# EasyEDA Pro project PixelScreen_WS2812B.eprj

# Schematic Schematic1

## Sheets
1 P1: Create Date: 2023-01-23; Page Name: P1; Project Name: PixelScreen_WS2812B; Schematic Name: Schematic1; Update Date: 2023-01-24; Company: 嘉立创EDA; Page Size: A4; Version: V1.0
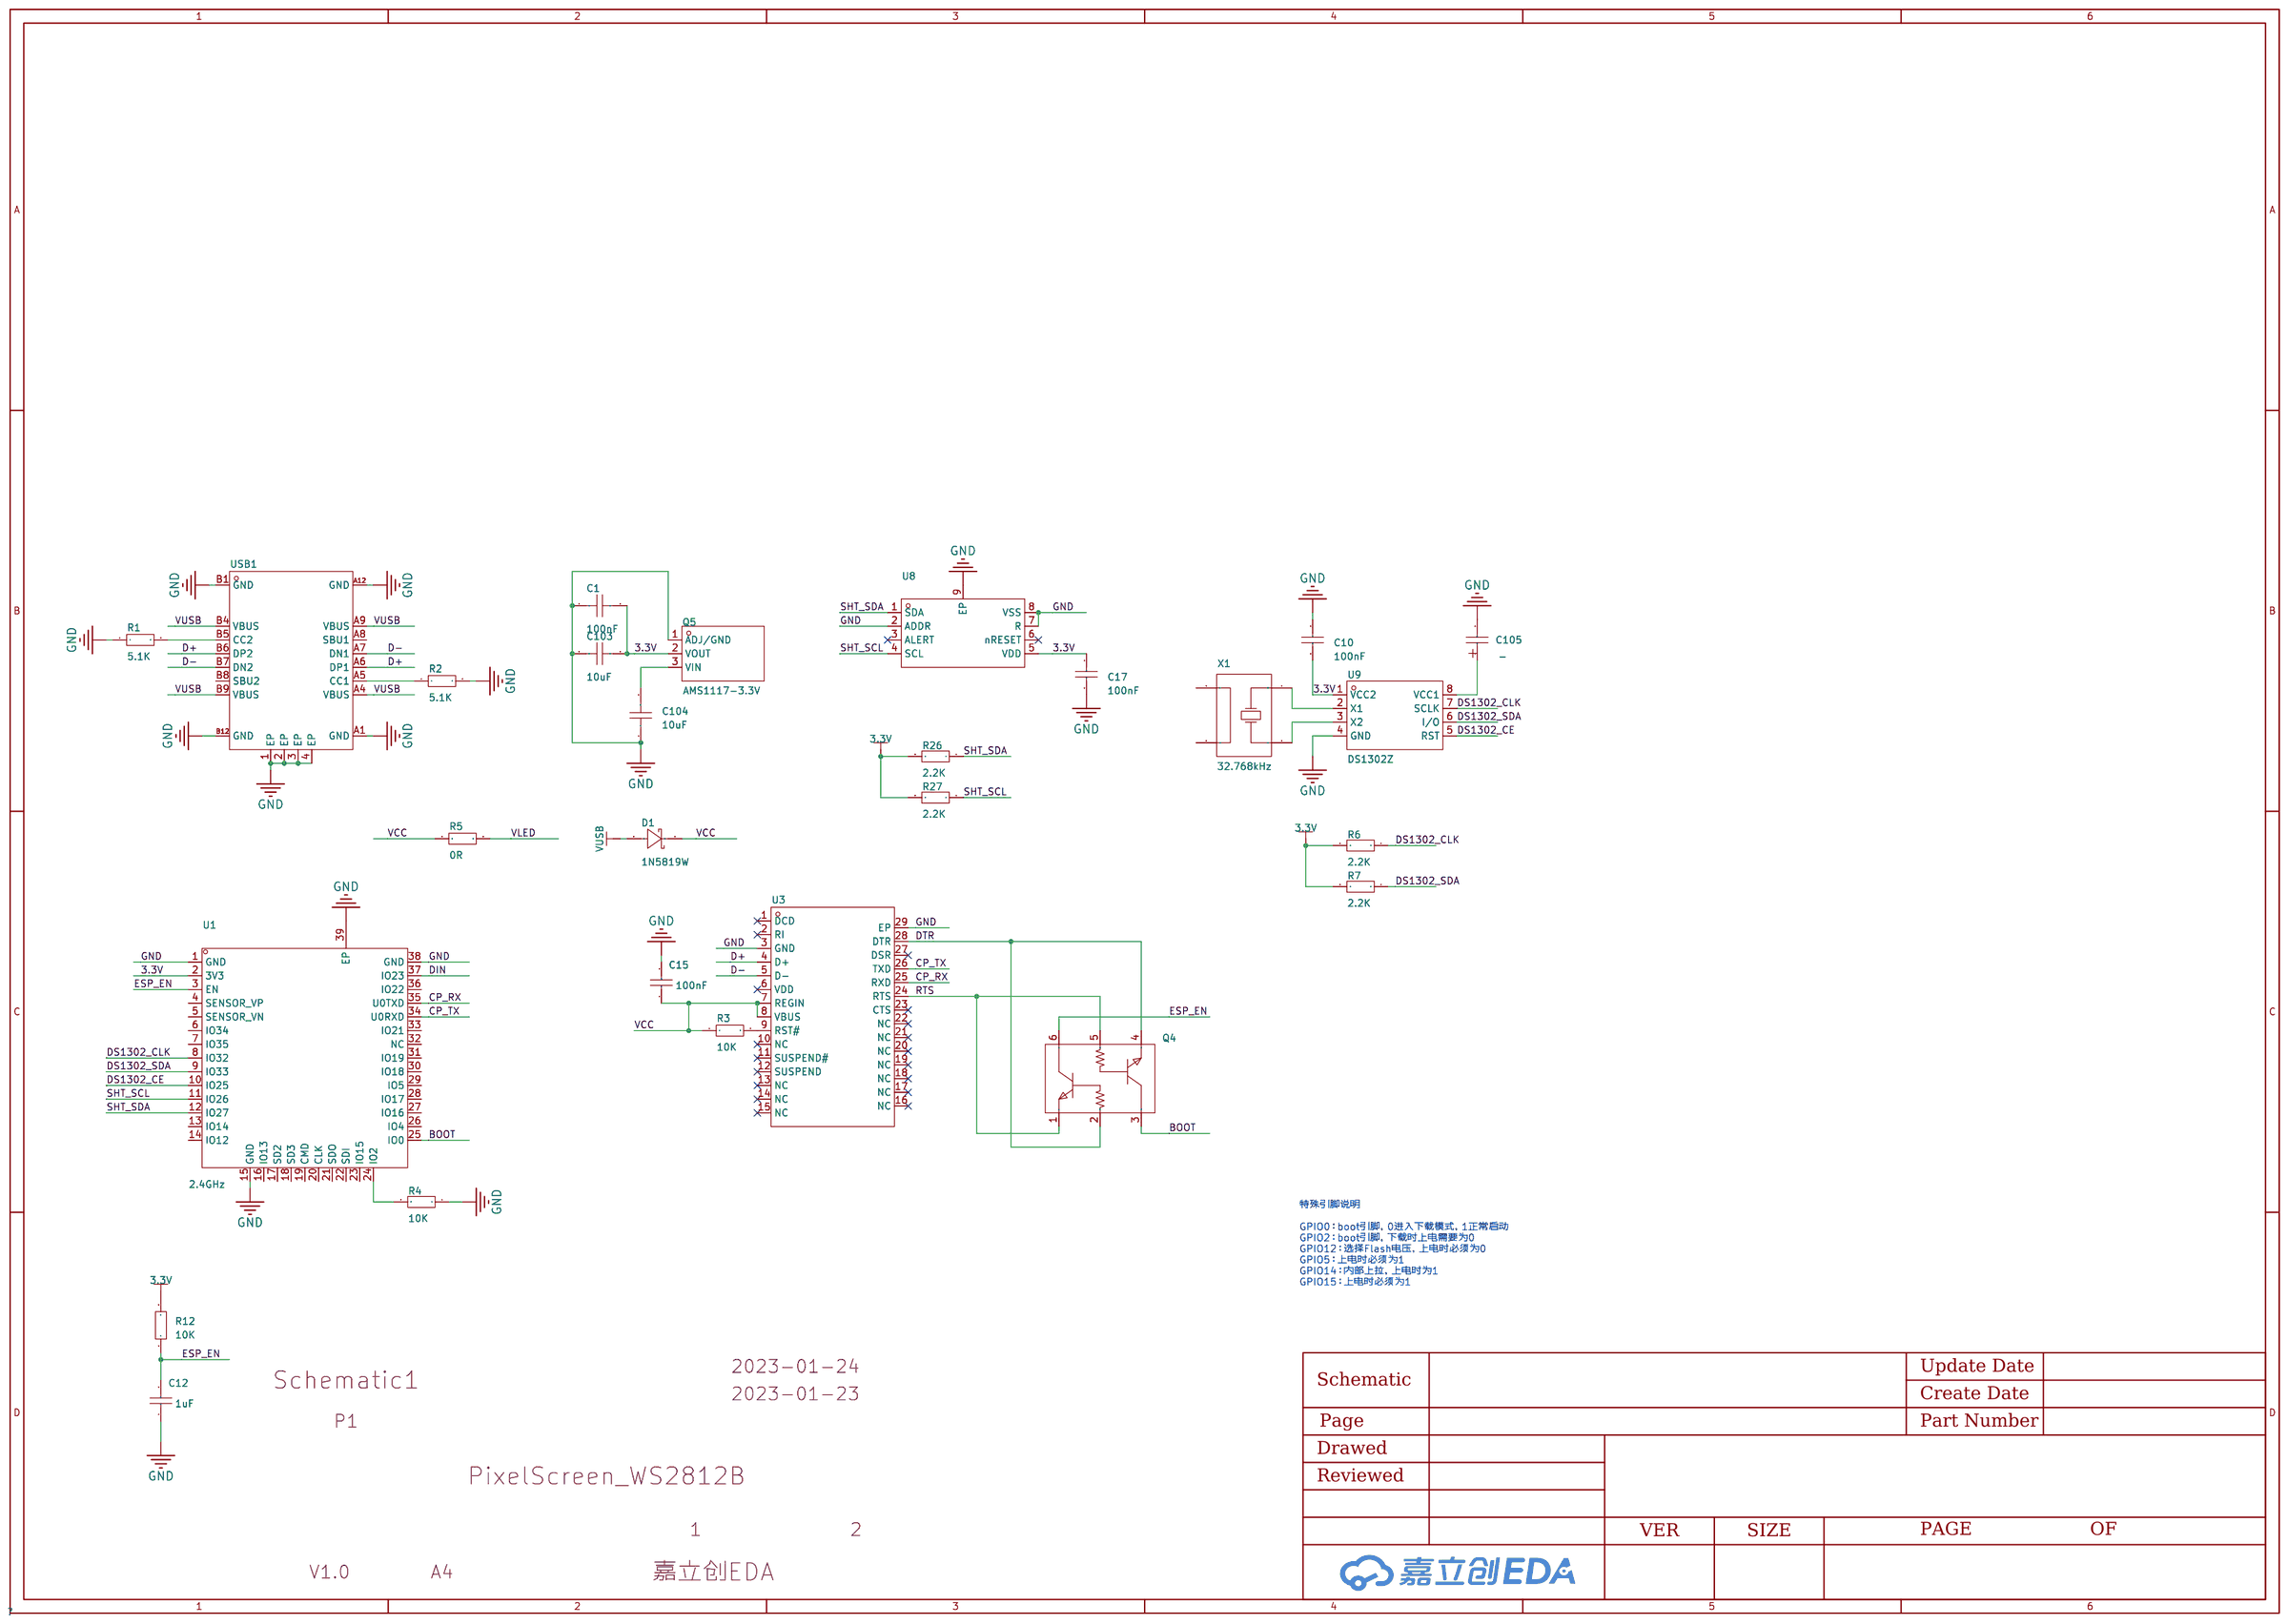
[diagram p0: P1]
2 P2: Page Name: P2
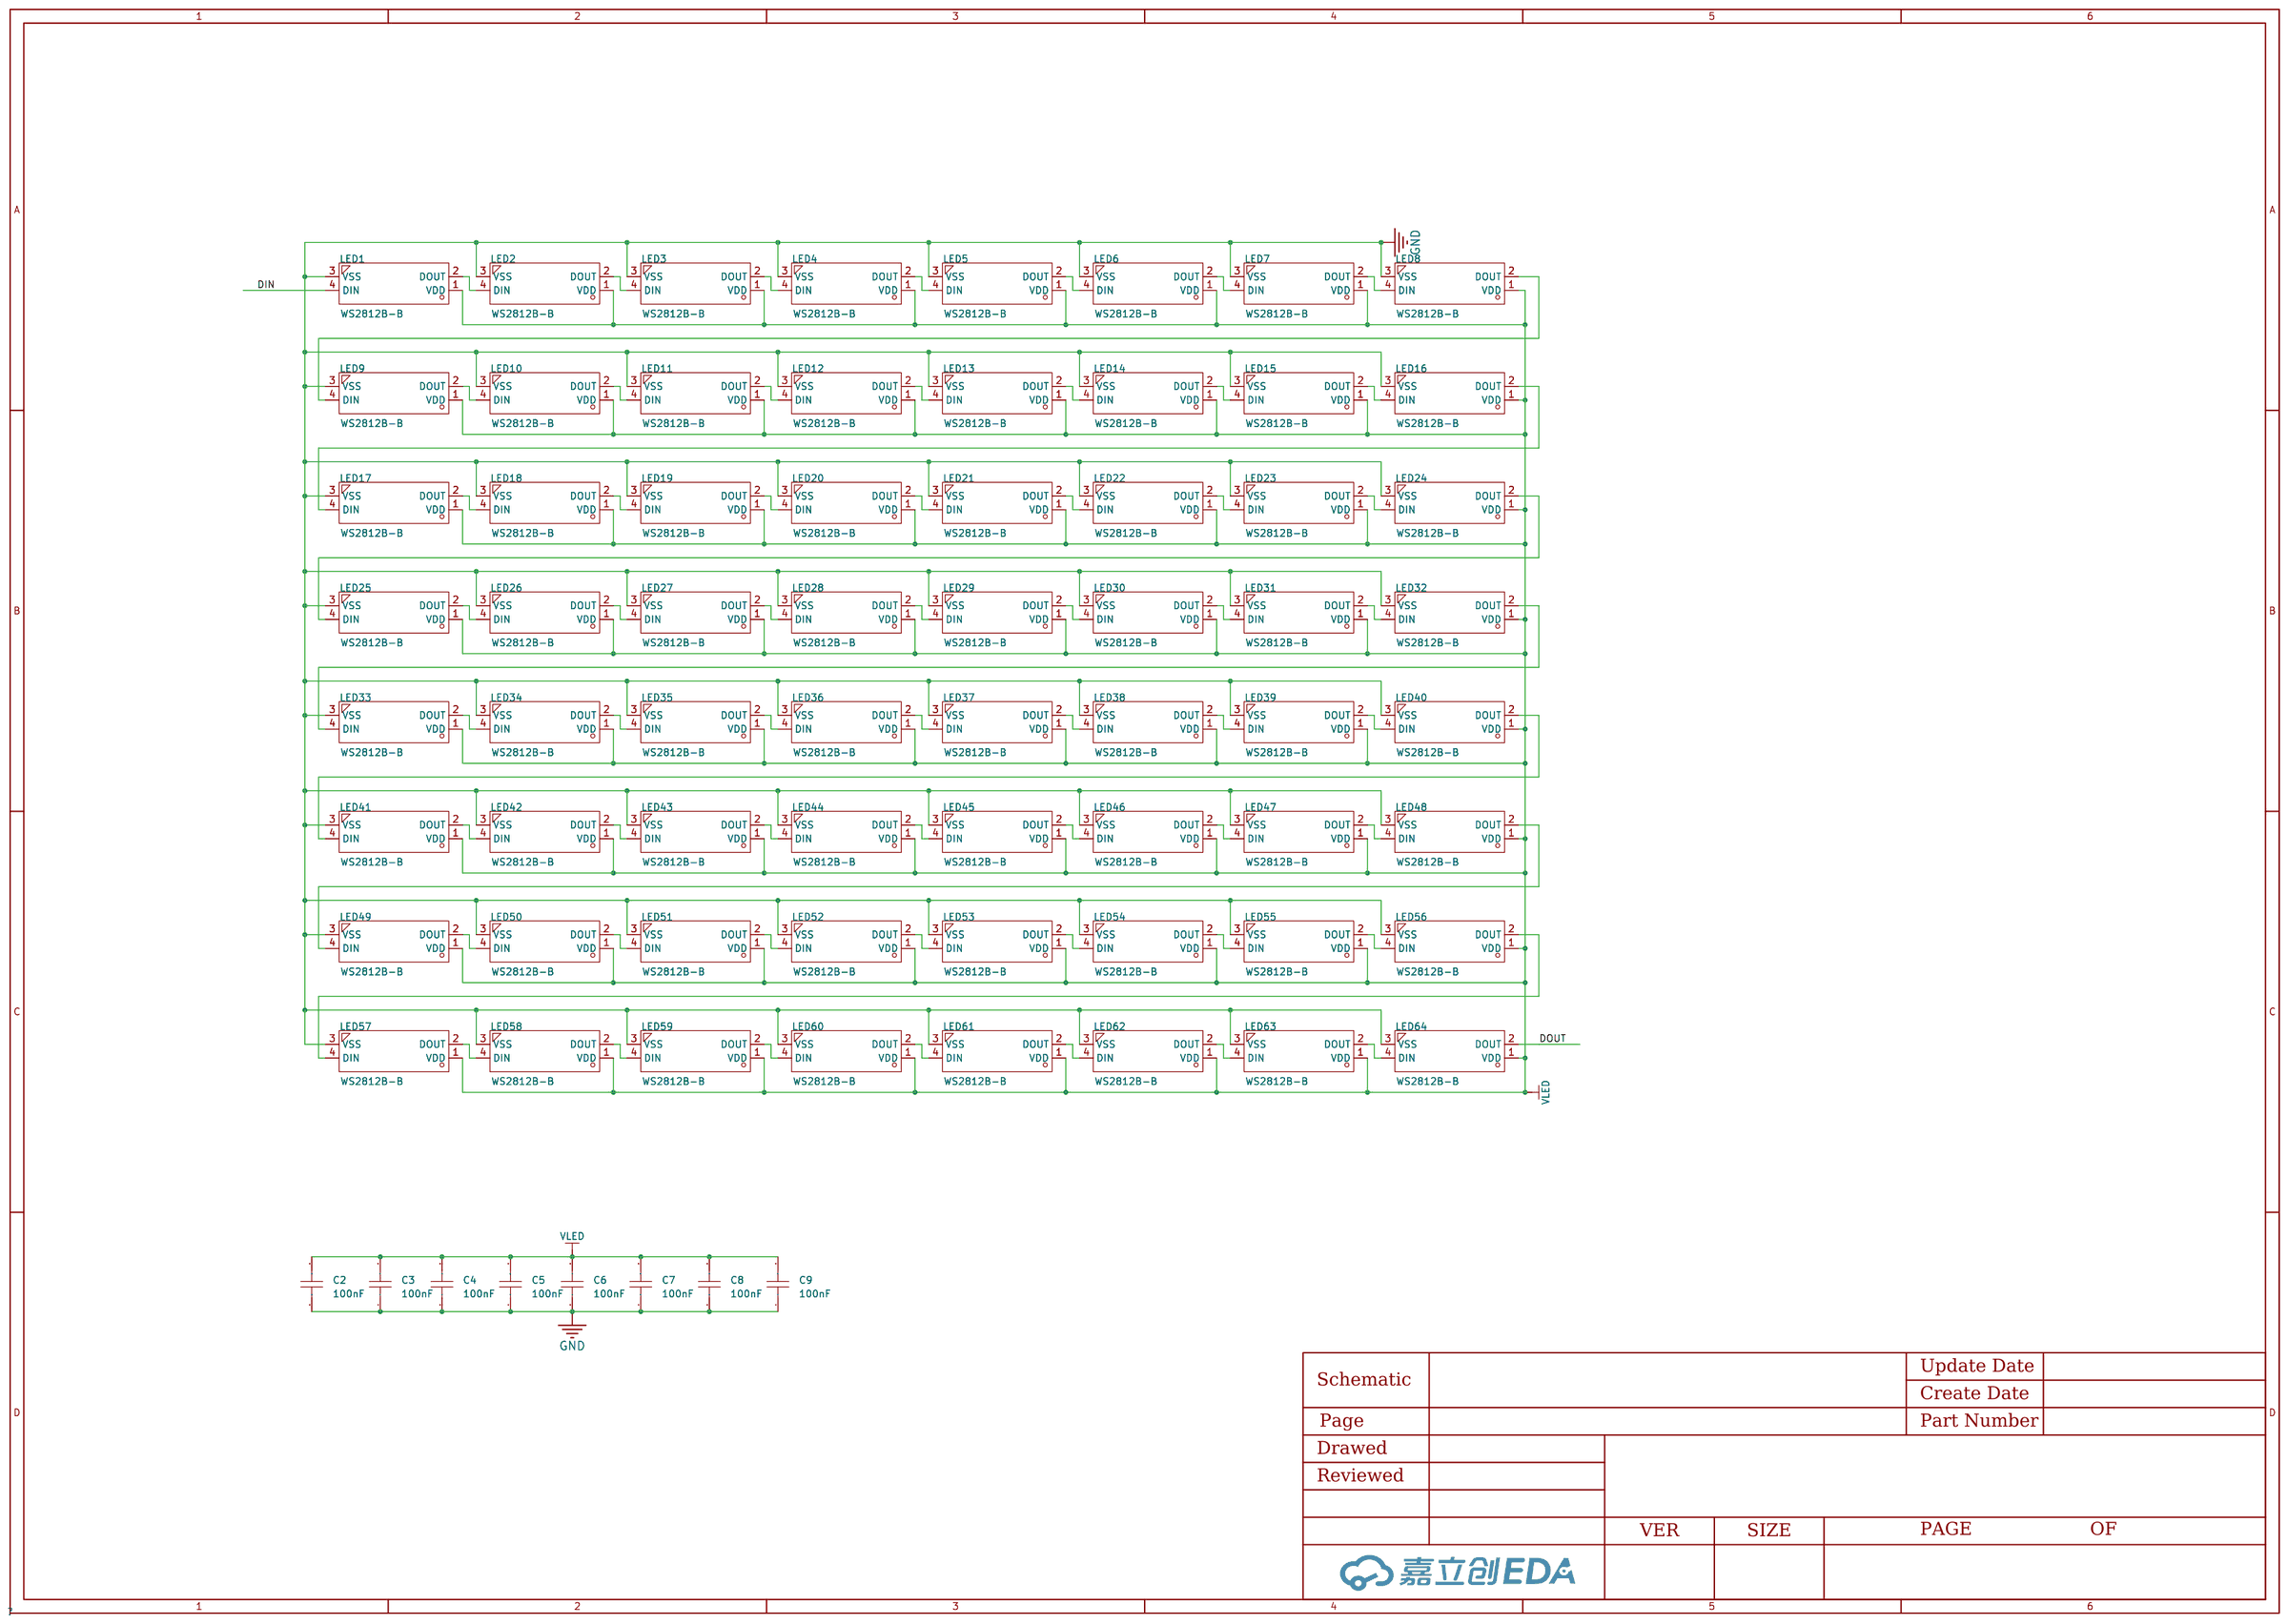
[diagram p1: P2]

## Parts
sheet P1
C1  100nF  [C0603]
C10  100nF  [C0402_NEW]
C12  1uF  [C0402_NEW]
C15  100nF  [C0402_NEW]
C17  100nF  [C0402_NEW]
C103  10uF  [C0603]
C104  10uF  [C0603]
C105  -  [CAP-TH_DMS3R3224]
D1  1N5819W  [SOD-123_L2.7-W1.6-LS3.7-RD-1]
Q4  UMH3N  [SC-70-6_L2.2-W1.3-P0.65-LS2.1-BR]
Q5  AMS1117-3.3V  [SOT-223_L6.5-W3.5-P2.30-LS7.0-BR]
R1  5.1K  [R0402]
R2  5.1K  [R0402]
R3  10K  [R0603]
R4  10K  [R0603]
R5  0R  [R0603]
R6  2.2K  [R0603]
R7  2.2K  [R0603]
R12  10K  [R0603]
R26  2.2K  [R0603]
R27  2.2K  [R0603]
U1  2.4GHz  [WIRELM-SMD_ESP32-S]
U3  -  [QFN-28_L5.0-W5.0-P0.50-TL-EP3.2]
U8  -  [DFN-8_L2.5-W2.5-P0.50-BL-EP]
U9  DS1302Z  [SOP-8_L4.9-W3.9-P1.27-LS6.0-BL-1]
USB1  -  [USB-C_16P_2]
X1  32.768kHz  [MC-146_4P-L6.7-W1.5-P0.85-TL]
sheet P2
C2  100nF  [C0603]
C3  100nF  [C0603]
C4  100nF  [C0603]
C5  100nF  [C0603]
C6  100nF  [C0603]
C7  100nF  [C0603]
C8  100nF  [C0603]
C9  100nF  [C0603]
LED1  WS2812B-B  [LED-SMD_4P-L5.0-W5.0-BL_TC5050RGB]
LED2  WS2812B-B  [LED-SMD_4P-L5.0-W5.0-BL_TC5050RGB]
LED3  WS2812B-B  [LED-SMD_4P-L5.0-W5.0-BL_TC5050RGB]
LED4  WS2812B-B  [LED-SMD_4P-L5.0-W5.0-BL_TC5050RGB]
LED5  WS2812B-B  [LED-SMD_4P-L5.0-W5.0-BL_TC5050RGB]
LED6  WS2812B-B  [LED-SMD_4P-L5.0-W5.0-BL_TC5050RGB]
LED7  WS2812B-B  [LED-SMD_4P-L5.0-W5.0-BL_TC5050RGB]
LED8  WS2812B-B  [LED-SMD_4P-L5.0-W5.0-BL_TC5050RGB]
LED9  WS2812B-B  [LED-SMD_4P-L5.0-W5.0-BL_TC5050RGB]
LED10  WS2812B-B  [LED-SMD_4P-L5.0-W5.0-BL_TC5050RGB]
LED11  WS2812B-B  [LED-SMD_4P-L5.0-W5.0-BL_TC5050RGB]
LED12  WS2812B-B  [LED-SMD_4P-L5.0-W5.0-BL_TC5050RGB]
LED13  WS2812B-B  [LED-SMD_4P-L5.0-W5.0-BL_TC5050RGB]
LED14  WS2812B-B  [LED-SMD_4P-L5.0-W5.0-BL_TC5050RGB]
LED15  WS2812B-B  [LED-SMD_4P-L5.0-W5.0-BL_TC5050RGB]
LED16  WS2812B-B  [LED-SMD_4P-L5.0-W5.0-BL_TC5050RGB]
LED17  WS2812B-B  [LED-SMD_4P-L5.0-W5.0-BL_TC5050RGB]
LED18  WS2812B-B  [LED-SMD_4P-L5.0-W5.0-BL_TC5050RGB]
LED19  WS2812B-B  [LED-SMD_4P-L5.0-W5.0-BL_TC5050RGB]
LED20  WS2812B-B  [LED-SMD_4P-L5.0-W5.0-BL_TC5050RGB]
LED21  WS2812B-B  [LED-SMD_4P-L5.0-W5.0-BL_TC5050RGB]
LED22  WS2812B-B  [LED-SMD_4P-L5.0-W5.0-BL_TC5050RGB]
LED23  WS2812B-B  [LED-SMD_4P-L5.0-W5.0-BL_TC5050RGB]
LED24  WS2812B-B  [LED-SMD_4P-L5.0-W5.0-BL_TC5050RGB]
LED25  WS2812B-B  [LED-SMD_4P-L5.0-W5.0-BL_TC5050RGB]
LED26  WS2812B-B  [LED-SMD_4P-L5.0-W5.0-BL_TC5050RGB]
LED27  WS2812B-B  [LED-SMD_4P-L5.0-W5.0-BL_TC5050RGB]
LED28  WS2812B-B  [LED-SMD_4P-L5.0-W5.0-BL_TC5050RGB]
LED29  WS2812B-B  [LED-SMD_4P-L5.0-W5.0-BL_TC5050RGB]
LED30  WS2812B-B  [LED-SMD_4P-L5.0-W5.0-BL_TC5050RGB]
LED31  WS2812B-B  [LED-SMD_4P-L5.0-W5.0-BL_TC5050RGB]
LED32  WS2812B-B  [LED-SMD_4P-L5.0-W5.0-BL_TC5050RGB]
LED33  WS2812B-B  [LED-SMD_4P-L5.0-W5.0-BL_TC5050RGB]
LED34  WS2812B-B  [LED-SMD_4P-L5.0-W5.0-BL_TC5050RGB]
LED35  WS2812B-B  [LED-SMD_4P-L5.0-W5.0-BL_TC5050RGB]
LED36  WS2812B-B  [LED-SMD_4P-L5.0-W5.0-BL_TC5050RGB]
LED37  WS2812B-B  [LED-SMD_4P-L5.0-W5.0-BL_TC5050RGB]
LED38  WS2812B-B  [LED-SMD_4P-L5.0-W5.0-BL_TC5050RGB]
LED39  WS2812B-B  [LED-SMD_4P-L5.0-W5.0-BL_TC5050RGB]
LED40  WS2812B-B  [LED-SMD_4P-L5.0-W5.0-BL_TC5050RGB]
LED41  WS2812B-B  [LED-SMD_4P-L5.0-W5.0-BL_TC5050RGB]
LED42  WS2812B-B  [LED-SMD_4P-L5.0-W5.0-BL_TC5050RGB]
LED43  WS2812B-B  [LED-SMD_4P-L5.0-W5.0-BL_TC5050RGB]
LED44  WS2812B-B  [LED-SMD_4P-L5.0-W5.0-BL_TC5050RGB]
LED45  WS2812B-B  [LED-SMD_4P-L5.0-W5.0-BL_TC5050RGB]
LED46  WS2812B-B  [LED-SMD_4P-L5.0-W5.0-BL_TC5050RGB]
LED47  WS2812B-B  [LED-SMD_4P-L5.0-W5.0-BL_TC5050RGB]
LED48  WS2812B-B  [LED-SMD_4P-L5.0-W5.0-BL_TC5050RGB]
LED49  WS2812B-B  [LED-SMD_4P-L5.0-W5.0-BL_TC5050RGB]
LED50  WS2812B-B  [LED-SMD_4P-L5.0-W5.0-BL_TC5050RGB]
LED51  WS2812B-B  [LED-SMD_4P-L5.0-W5.0-BL_TC5050RGB]
LED52  WS2812B-B  [LED-SMD_4P-L5.0-W5.0-BL_TC5050RGB]
LED53  WS2812B-B  [LED-SMD_4P-L5.0-W5.0-BL_TC5050RGB]
LED54  WS2812B-B  [LED-SMD_4P-L5.0-W5.0-BL_TC5050RGB]
LED55  WS2812B-B  [LED-SMD_4P-L5.0-W5.0-BL_TC5050RGB]
LED56  WS2812B-B  [LED-SMD_4P-L5.0-W5.0-BL_TC5050RGB]
LED57  WS2812B-B  [LED-SMD_4P-L5.0-W5.0-BL_TC5050RGB]
LED58  WS2812B-B  [LED-SMD_4P-L5.0-W5.0-BL_TC5050RGB]
LED59  WS2812B-B  [LED-SMD_4P-L5.0-W5.0-BL_TC5050RGB]
LED60  WS2812B-B  [LED-SMD_4P-L5.0-W5.0-BL_TC5050RGB]
LED61  WS2812B-B  [LED-SMD_4P-L5.0-W5.0-BL_TC5050RGB]
LED62  WS2812B-B  [LED-SMD_4P-L5.0-W5.0-BL_TC5050RGB]
LED63  WS2812B-B  [LED-SMD_4P-L5.0-W5.0-BL_TC5050RGB]
LED64  WS2812B-B  [LED-SMD_4P-L5.0-W5.0-BL_TC5050RGB]

## Library data of the parts
C1-C9 C103 C104 = CAP_0603: Supplier Footprint: 0603
C10 C12 C15 C17 = CL05B104KO5NNNC: 容值:100nF;精度:±10%;额定电压:16V;材质(温度系数):X7R;; LCSC Part Name: 100nF ±10% 16V; Supplier Part: C1525; Manufacturer: SAMSUNG(三星); Supplier Footprint: 0402; JLCPCB Part Class: Basic Part; Datasheet: https://atta.szlcsc.com/upload/public/pdf/source/20160103/1457707674891.pdf; Supplier: LCSC; Tolerance: ±10%; Voltage Rated: 16V; Temperature Coefficient: X7R
C105 = DMS3R3224R: 容值:-;精度:-;额定电压:-;等效串联电阻:-;漏电流:-;工作寿命:-;循环寿命:-;工作温度:-;电容体直径:-;电容体高:-;; LCSC Part Name: DMS3R3224R 停产 DMS系列超级电容不允许使用回流焊方式加工焊接; Supplier Part: C113705; Manufacturer: KORCHIP(高奇普); Supplier Footprint: SMD,6.8x1.4mm; JLCPCB Part Class: Extended Part; Datasheet: https://atta.szlcsc.com/upload/public/pdf/source/20221123/7966B40935DB6FC5ACECC2C88E7D4327.pdf; Supplier: LCSC
D1 = 1N5819W: 二极管配置:-;直流反向耐压(Vr):40V;平均整流电流(Io):1A;正向压降(Vf):900mV@3A;反向电流(Ir):1mA@40V;; LCSC Part Name: 40V 1A 900mV@3A; Supplier Part: C2905650; Manufacturer: TECH PUBLIC(台舟); Supplier Footprint: SOD-123; JLCPCB Part Class: Extended Part; Datasheet: https://atta.szlcsc.com/upload/public/pdf/source/20211020/7FEA34DA99E5285CBA3CC87767B82BE7.pdf; Supplier: LCSC; Reverse Voltage (Vr): 40V; Average Rectified Current (Io): 1A; Forward Voltage (Vf@If): 900mV@3A; Reverse Leakage Current (Ir): 1mA@40V
Q4 = UMH3N: 晶体管类型:2个NPN-预偏置;功率(Pd):150mW;集电极电流(Ic):100mA;集射极击穿电压(Vceo):50V;; LCSC Part Name: 2个NPN-预偏置 100mA 50V; Supplier Part: C62892; Manufacturer: CJ(江苏长电/长晶); Supplier Footprint: SC-70-6(SOT-363); JLCPCB Part Class: Extended Part; Datasheet: https://atta.szlcsc.com/upload/public/pdf/source/20151109/1457707575095.pdf; Supplier: LCSC; Transistor Type: 2个NPN-预偏置; Power Dissipation (Pd): 150mW; Collector Current (Ic): 100mA; Collector-Emitter Breakdown Voltage (Vceo): 50V
Q5 = AMS1117-3.3V_C5120796: 输出类型:固定;输出极性:正;输出通道数:1;最大输入电压:18V;输出电压:3.3V;压差:1.4V@(1A);静态电流(地电流):12mA;输出电流:1A;工作温度:0℃~+125℃;; LCSC Part Name: 正 Vin=18V Vout=3.3V 1A; Supplier Part: C5120796; Manufacturer: MSKSEMI(美森科); Supplier Footprint: SOT-89; JLCPCB Part Class: Extended Part; Datasheet: https://atta.szlcsc.com/upload/public/pdf/source/20220727/5E62EAC46FFFF83337622C0FBE1B6BF8.pdf; Supplier: LCSC; Output Type: 固定; Output Polarity: 正; Number of Outputs: 1; Maximum Input Voltage: 18V; Output Voltage: 3.3V; Dropout Voltage: 1.4V@(1A); Quiescent Current (Ground Current): 12mA; Output Current: 1A; Operating Temperature: 0℃~+125℃
R1-R7 R12 R26 R27 = Res_0402: Supplier Footprint: 0402
U1 = ESP32-S: 频率:2.4GHz;发射功率:17dBm;核心处理器:LX6;天线形式:板载 PCB 天线/外接 IPEX;接收灵敏度:-90dBm;; Supplier Part: C277944; Manufacturer: Ai-Thinker(安信可); Supplier Footprint: SMD; JLCPCB Part Class: Extended Part; Datasheet: https://atta.szlcsc.com/upload/public/pdf/source/20211217/F4BEA33E732D6002D10DAED85BBCB52B.pdf; Supplier: LCSC; Output Power: 17dBm; Core Processor: LX6; Support Interface: I2C；UART；DAC；SPI；PWM；ADC; Antenna Type: 板载 PCB 天线/外接 IPEX; Wireless Standard: 802.11b/g/n; Operating Voltage: 3.3V; Sensitivity: -90dBm; Operating Temperature: -40℃~+85℃
U3 = CP2102: Supplier Part: C9900004371; Supplier Footprint: QFN-28_L5.0-W5.0-P0.50-EP3.2; JLCPCB Part Class: Extended Part; Datasheet: https://atta.szlcsc.comnull; Supplier: LCSC
U8 = SHT30-DIS-B10KS: 传感器类型:-;输出类型:-;温度范围:-;湿度范围:-;精度:-;; LCSC Part Name: SHT30-DIS; Supplier Part: C2687423; Manufacturer: Sensirion(瑞士盛思锐); Supplier Footprint: DFN-8; JLCPCB Part Class: Extended Part; Datasheet: https://atta.szlcsc.com/upload/public/pdf/source/20210120/C2687423_31DB3FACC3E95675626B9DEF500B4777.pdf; Supplier: LCSC
U9 = DS1302Z: LCSC Part Name: 集成电路; Supplier Part: C2900599; Manufacturer: JSMSEMI(杰盛微); Supplier Footprint: SOP-8; JLCPCB Part Class: Extended Part; Datasheet: https://atta.szlcsc.com/upload/public/pdf/source/20221009/5700B6A9835E9B83F98C0CA5E371583C.pdf; Supplier: LCSC
USB1 = typec: Supplier Part: C9900016956; Supplier Footprint: typec 12p; JLCPCB Part Class: Extended Part; Datasheet: https://atta.szlcsc.comnull; Supplier: LCSC
X1 = MC-14632.768kHz7.0pF20PPM: 晶振类型:贴片无源晶振;频率:32.768kHz;频率公差:±20ppm;负载电容:7pF;等效串联电阻(ESR):65kΩ;工作温度:-40℃~+85℃;; LCSC Part Name: 32.768kHz ±20ppm 7pF; Supplier Part: C94977; Manufacturer: EPSON(爱普生); Supplier Footprint: MC-146; JLCPCB Part Class: Extended Part; Datasheet: https://atta.szlcsc.com/upload/public/pdf/source/20170211/1486785670215.pdf; Supplier: LCSC; Crystal Type: 贴片无源晶振; Frequency Tolerance: ±20ppm; Load Capacitance: 7pF; Equivalent Series Resistance (ESR): 65kΩ; Operating Temperature: -40℃~+85℃
LED1-LED64 = WS2812B-B: 发光颜色:RGB三色;; LCSC Part Name: RGB三色 （注意防潮，请查阅规格书中对应具体内容）; Supplier Part: C114586; Manufacturer: worldsemi; Supplier Footprint: SMD5050; JLCPCB Part Class: Extended Part; Datasheet: https://atta.szlcsc.com/upload/public/pdf/source/20200615/C114586_26EB6813EC9F2A3F6C7FBB2AD75DE01F.pdf; Supplier: LCSC; Emitted Color: RGB三色

## Nets
3.3V: C1.2 C10.2 C17.1 C103.2 Q5.2(VOUT) R6.2 R7.2 R12.2 R26.2 R27.2 U1.2(3V3) U8.5(VDD) U9.1(VCC2)
GND: C1.1 C2.1 C3.1 C4.1 C5.1 C6.1 C7.1 C8.1 C9.1 C10.1 C12.1 C15.2 C17.2 C103.1 C104.1 C105.2 LED1.3(VSS) LED2.3(VSS) LED3.3(VSS) LED4.3(VSS) LED5.3(VSS) LED6.3(VSS) LED7.3(VSS) LED8.3(VSS) LED9.3(VSS) LED10.3(VSS) LED11.3(VSS) LED12.3(VSS) LED13.3(VSS) LED14.3(VSS) LED15.3(VSS) LED16.3(VSS) LED17.3(VSS) LED18.3(VSS) LED19.3(VSS) LED20.3(VSS) LED21.3(VSS) LED22.3(VSS) LED23.3(VSS) LED24.3(VSS) LED25.3(VSS) LED26.3(VSS) LED27.3(VSS) LED28.3(VSS) LED29.3(VSS) LED30.3(VSS) LED31.3(VSS) LED32.3(VSS) LED33.3(VSS) LED34.3(VSS) LED35.3(VSS) LED36.3(VSS) LED37.3(VSS) LED38.3(VSS) LED39.3(VSS) LED40.3(VSS) LED41.3(VSS) LED42.3(VSS) LED43.3(VSS) LED44.3(VSS) LED45.3(VSS) LED46.3(VSS) LED47.3(VSS) LED48.3(VSS) LED49.3(VSS) LED50.3(VSS) LED51.3(VSS) LED52.3(VSS) LED53.3(VSS) LED54.3(VSS) LED55.3(VSS) LED56.3(VSS) LED57.3(VSS) LED58.3(VSS) LED59.3(VSS) LED60.3(VSS) LED61.3(VSS) LED62.3(VSS) LED63.3(VSS) LED64.3(VSS) Q5.1(ADJ/GND) R1.1 R2.2 R4.1 U1.1(GND) U1.15(GND) U1.38(GND) U1.39(EP) U3.3(GND) U3.29(EP) U8.2(ADDR) U8.7(R) U8.8(VSS) U8.9(EP) U9.4(GND) USB1.1(EP) USB1.2(EP) USB1.3(EP) USB1.4(EP) USB1.A1(GND) USB1.A12(GND) USB1.B1(GND) USB1.B12(GND)
VCC: C15.1 D1.1(K) R3.1 R5.1 U3.7(REGIN) U3.8(VBUS)
BOOT: Q4.3(C) U1.25(IO0)
CP_RX: U1.35(U0TXD) U3.25(RXD)
CP_TX: U1.34(U0RXD) U3.26(TXD)
D+: U3.4(D+) USB1.A6(DP1) USB1.B6(DP2)
D-: U3.5(D-) USB1.A7(DN1) USB1.B7(DN2)
DIN: LED1.4(DIN) U1.37(IO23)
DOUT: LED64.2(DOUT)
DS1302_CE: U1.10(IO25) U9.5(RST)
DS1302_CLK: R6.1 U1.8(IO32) U9.7(SCLK)
DS1302_SDA: R7.1 U1.9(IO33) U9.6(I/O)
DTR: Q4.2(B) Q4.4(E) U3.28(DTR)
ESP_EN: C12.2 Q4.6(C) R12.1 U1.3(EN)
RTS: Q4.1(E) Q4.5(B) U3.24(RTS)
SHT_SCL: R27.1 U1.11(IO26) U8.4(SCL)
SHT_SDA: R26.1 U1.12(IO27) U8.1(SDA)
VLED: C2.2 C3.2 C4.2 C5.2 C6.2 C7.2 C8.2 C9.2 LED1.1(VDD) LED2.1(VDD) LED3.1(VDD) LED4.1(VDD) LED5.1(VDD) LED6.1(VDD) LED7.1(VDD) LED8.1(VDD) LED9.1(VDD) LED10.1(VDD) LED11.1(VDD) LED12.1(VDD) LED13.1(VDD) LED14.1(VDD) LED15.1(VDD) LED16.1(VDD) LED17.1(VDD) LED18.1(VDD) LED19.1(VDD) LED20.1(VDD) LED21.1(VDD) LED22.1(VDD) LED23.1(VDD) LED24.1(VDD) LED25.1(VDD) LED26.1(VDD) LED27.1(VDD) LED28.1(VDD) LED29.1(VDD) LED30.1(VDD) LED31.1(VDD) LED32.1(VDD) LED33.1(VDD) LED34.1(VDD) LED35.1(VDD) LED36.1(VDD) LED37.1(VDD) LED38.1(VDD) LED39.1(VDD) LED40.1(VDD) LED41.1(VDD) LED42.1(VDD) LED43.1(VDD) LED44.1(VDD) LED45.1(VDD) LED46.1(VDD) LED47.1(VDD) LED48.1(VDD) LED49.1(VDD) LED50.1(VDD) LED51.1(VDD) LED52.1(VDD) LED53.1(VDD) LED54.1(VDD) LED55.1(VDD) LED56.1(VDD) LED57.1(VDD) LED58.1(VDD) LED59.1(VDD) LED60.1(VDD) LED61.1(VDD) LED62.1(VDD) LED63.1(VDD) LED64.1(VDD) R5.2
VUSB: D1.2(A) USB1.A4(VBUS) USB1.A9(VBUS) USB1.B4(VBUS) USB1.B9(VBUS)
$1N1863: R1.2 USB1.B5(CC2)
$1N1869: R2.1 USB1.A5(CC1)
$1N1877: R3.2 U3.9(RST#)
$1N30818: C104.2 Q5.3(VIN)
$1N36355: R4.2 U1.24(IO2)
$1N37451: U9.2(X1) X1.1(OSC1)
$1N37470: U9.3(X2) X1.4(OSC2)
$1N37627: C105.1 U9.8(VCC1)
$2N49017: LED1.2(DOUT) LED2.4(DIN)
$2N49022: LED2.2(DOUT) LED3.4(DIN)
$2N49027: LED3.2(DOUT) LED4.4(DIN)
$2N49225: LED5.2(DOUT) LED6.4(DIN)
$2N49226: LED6.2(DOUT) LED7.4(DIN)
$2N49317: LED4.2(DOUT) LED5.4(DIN)
$2N50284: LED9.2(DOUT) LED10.4(DIN)
$2N50285: LED10.2(DOUT) LED11.4(DIN)
$2N50286: LED11.2(DOUT) LED12.4(DIN)
$2N50287: LED13.2(DOUT) LED14.4(DIN)
$2N50288: LED14.2(DOUT) LED15.4(DIN)
$2N50289: LED15.2(DOUT) LED16.4(DIN)
$2N50290: LED12.2(DOUT) LED13.4(DIN)
$2N50470: LED8.2(DOUT) LED9.4(DIN)
$2N50637: LED7.2(DOUT) LED8.4(DIN)
$2N52267: LED17.2(DOUT) LED18.4(DIN)
$2N52268: LED18.2(DOUT) LED19.4(DIN)
$2N52269: LED19.2(DOUT) LED20.4(DIN)
$2N52270: LED21.2(DOUT) LED22.4(DIN)
$2N52271: LED22.2(DOUT) LED23.4(DIN)
$2N52272: LED20.2(DOUT) LED21.4(DIN)
$2N52273: LED25.2(DOUT) LED26.4(DIN)
$2N52274: LED26.2(DOUT) LED27.4(DIN)
$2N52275: LED27.2(DOUT) LED28.4(DIN)
$2N52276: LED29.2(DOUT) LED30.4(DIN)
$2N52277: LED30.2(DOUT) LED31.4(DIN)
$2N52278: LED31.2(DOUT) LED32.4(DIN)
$2N52279: LED28.2(DOUT) LED29.4(DIN)
$2N52280: LED24.2(DOUT) LED25.4(DIN)
$2N52282: LED23.2(DOUT) LED24.4(DIN)
$2N53315: LED16.2(DOUT) LED17.4(DIN)
$2N55722: LED33.2(DOUT) LED34.4(DIN)
$2N55723: LED34.2(DOUT) LED35.4(DIN)
$2N55724: LED35.2(DOUT) LED36.4(DIN)
$2N55725: LED37.2(DOUT) LED38.4(DIN)
$2N55726: LED38.2(DOUT) LED39.4(DIN)
$2N55727: LED36.2(DOUT) LED37.4(DIN)
$2N55728: LED41.2(DOUT) LED42.4(DIN)
$2N55729: LED42.2(DOUT) LED43.4(DIN)
$2N55730: LED43.2(DOUT) LED44.4(DIN)
$2N55731: LED45.2(DOUT) LED46.4(DIN)
$2N55732: LED46.2(DOUT) LED47.4(DIN)
$2N55733: LED47.2(DOUT) LED48.4(DIN)
$2N55734: LED44.2(DOUT) LED45.4(DIN)
$2N55735: LED40.2(DOUT) LED41.4(DIN)
$2N55736: LED39.2(DOUT) LED40.4(DIN)
$2N55738: LED49.2(DOUT) LED50.4(DIN)
$2N55739: LED50.2(DOUT) LED51.4(DIN)
$2N55740: LED51.2(DOUT) LED52.4(DIN)
$2N55741: LED53.2(DOUT) LED54.4(DIN)
$2N55742: LED54.2(DOUT) LED55.4(DIN)
$2N55743: LED52.2(DOUT) LED53.4(DIN)
$2N55744: LED57.2(DOUT) LED58.4(DIN)
$2N55745: LED58.2(DOUT) LED59.4(DIN)
$2N55746: LED59.2(DOUT) LED60.4(DIN)
$2N55747: LED61.2(DOUT) LED62.4(DIN)
$2N55748: LED62.2(DOUT) LED63.4(DIN)
$2N55749: LED63.2(DOUT) LED64.4(DIN)
$2N55750: LED60.2(DOUT) LED61.4(DIN)
$2N55751: LED48.2(DOUT) LED49.4(DIN)
$2N55753: LED55.2(DOUT) LED56.4(DIN)
$2N55754: LED56.2(DOUT) LED57.4(DIN)
$2N56561: LED32.2(DOUT) LED33.4(DIN)

Not connected (* = marked no-connect by the designer): U1 4(SENSOR_VP) 5(SENSOR_VN) 6(IO34) 7(IO35) 13(IO14) 14(IO12) 16(IO13) 17(SD2) 18(SD3) 19(CMD) 20(CLK) 21(SDO) 22(SDI) 23(IO15) 26(IO4) 27(IO16) 28(IO17) 29(IO5) 30(IO18) 31(IO19) 32(NC) 33(IO21) 36(IO22); U3 1(DCD)* 2(RI)* 6(VDD)* 10(NC)* 11(SUSPEND#)* 12(SUSPEND)* 13(NC)* 14(NC)* 15(NC)* 16(NC)* 17(NC)* 18(NC)* 19(NC)* 20(NC)* 21(NC)* 22(NC)* 23(CTS)* 27(DSR)*; U8 3(ALERT)* 6(nRESET)*; USB1 A8(SBU1) B8(SBU2); X1 2 3

## Notes on the sheets
sheet 1
- 特殊引脚说明
  GPIO0：boot引脚，0进入下载模式，1正常启动
  GPIO2：boot引脚，下载时上电需要为0
  GPIO12：选择Flash电压，上电时必须为0
  GPIO5：上电时必须为1
  GPIO14：内部上拉，上电时为1
  GPIO15：上电时必须为1

# Board PCB1
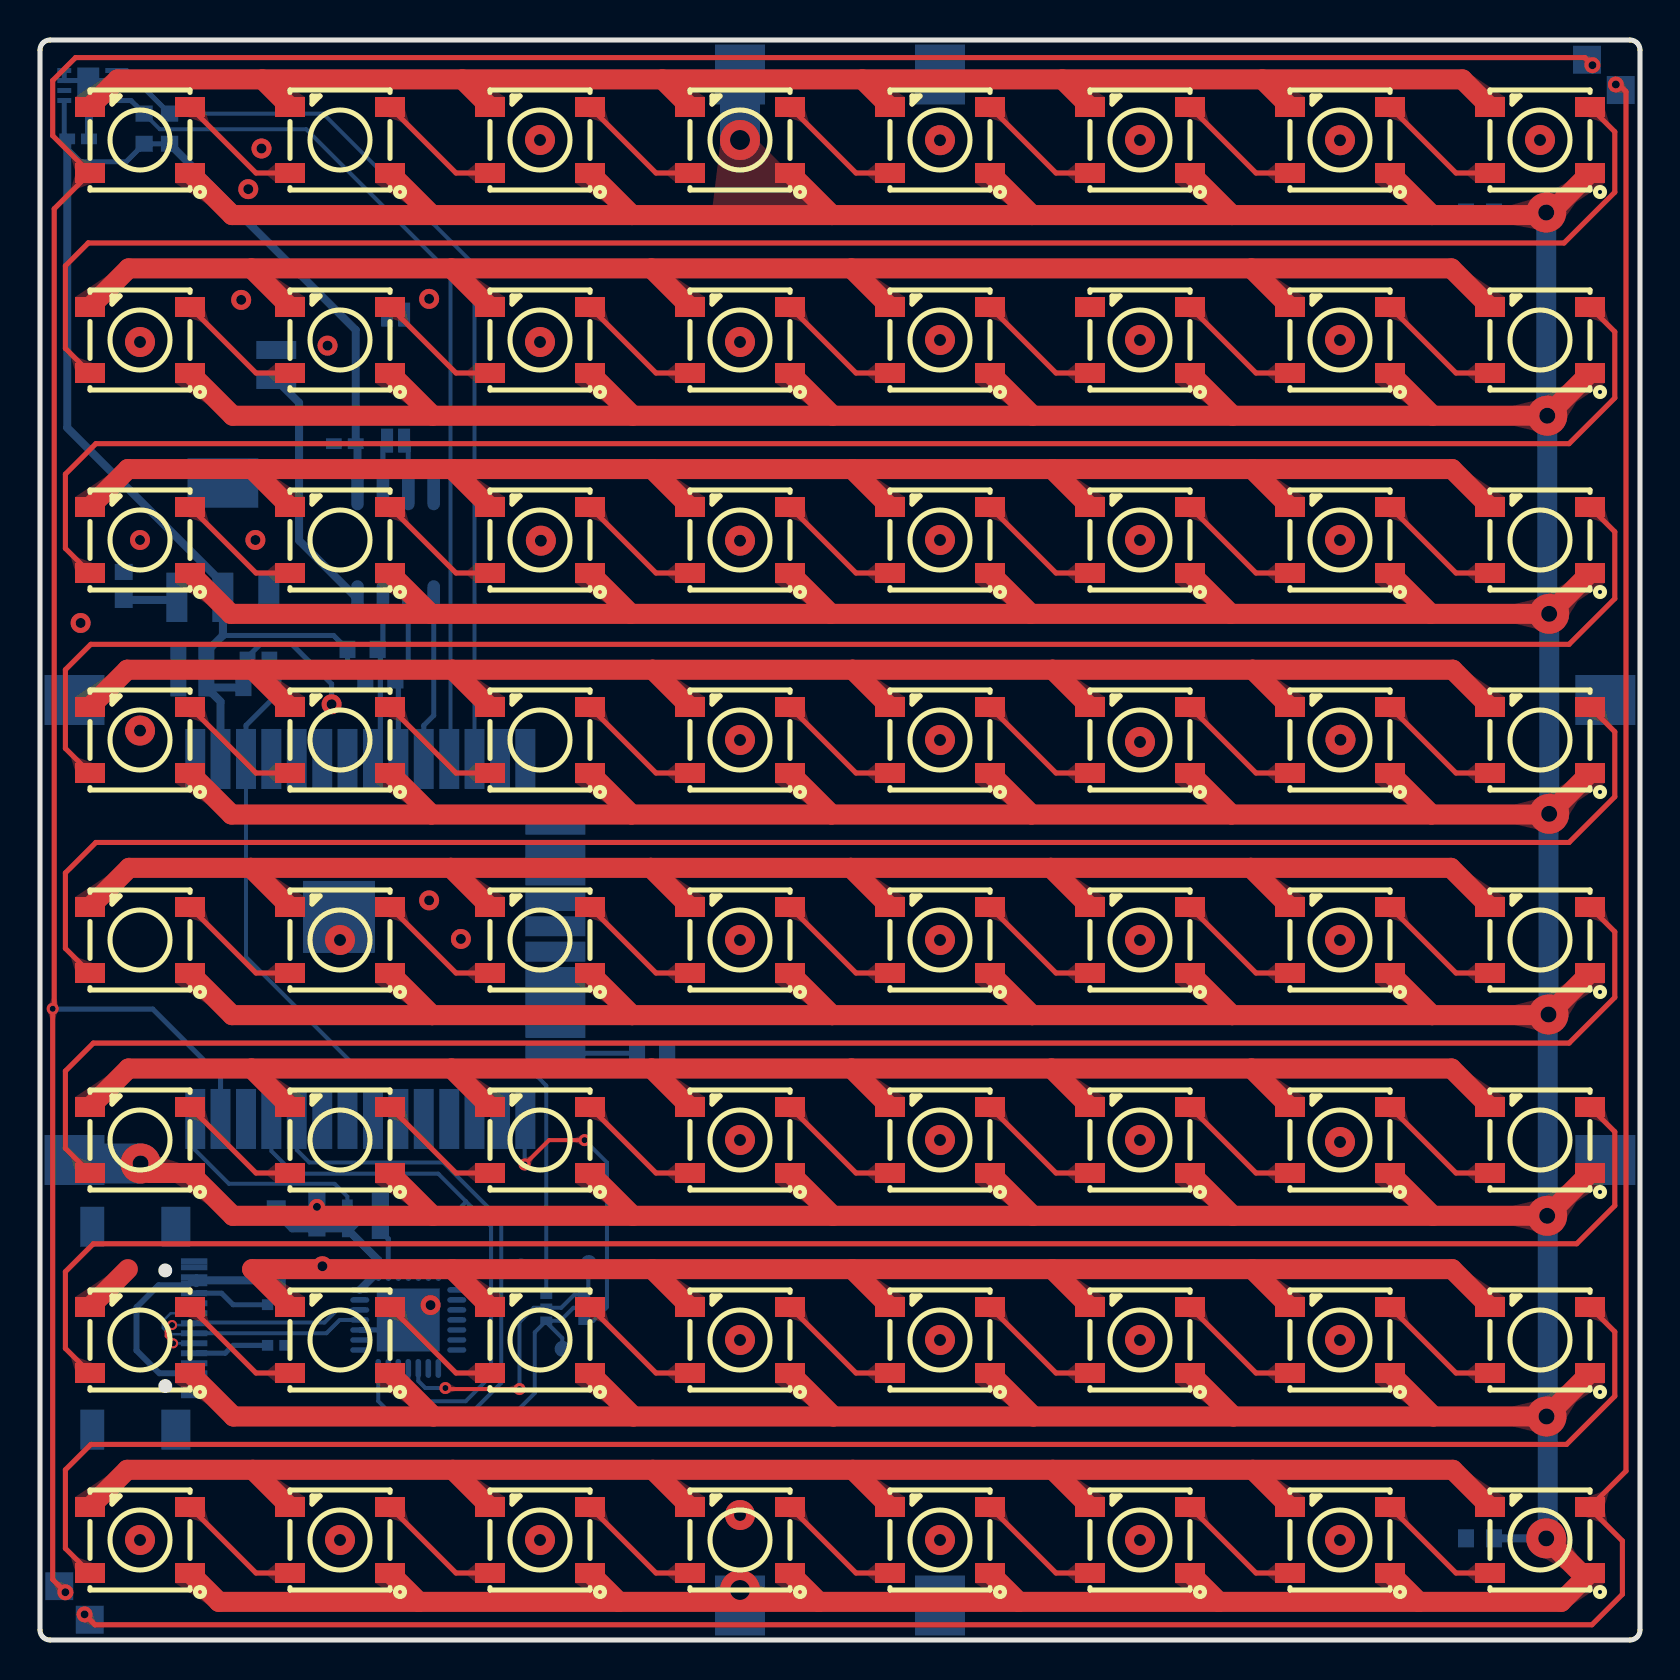
[diagram p2: board, top side]
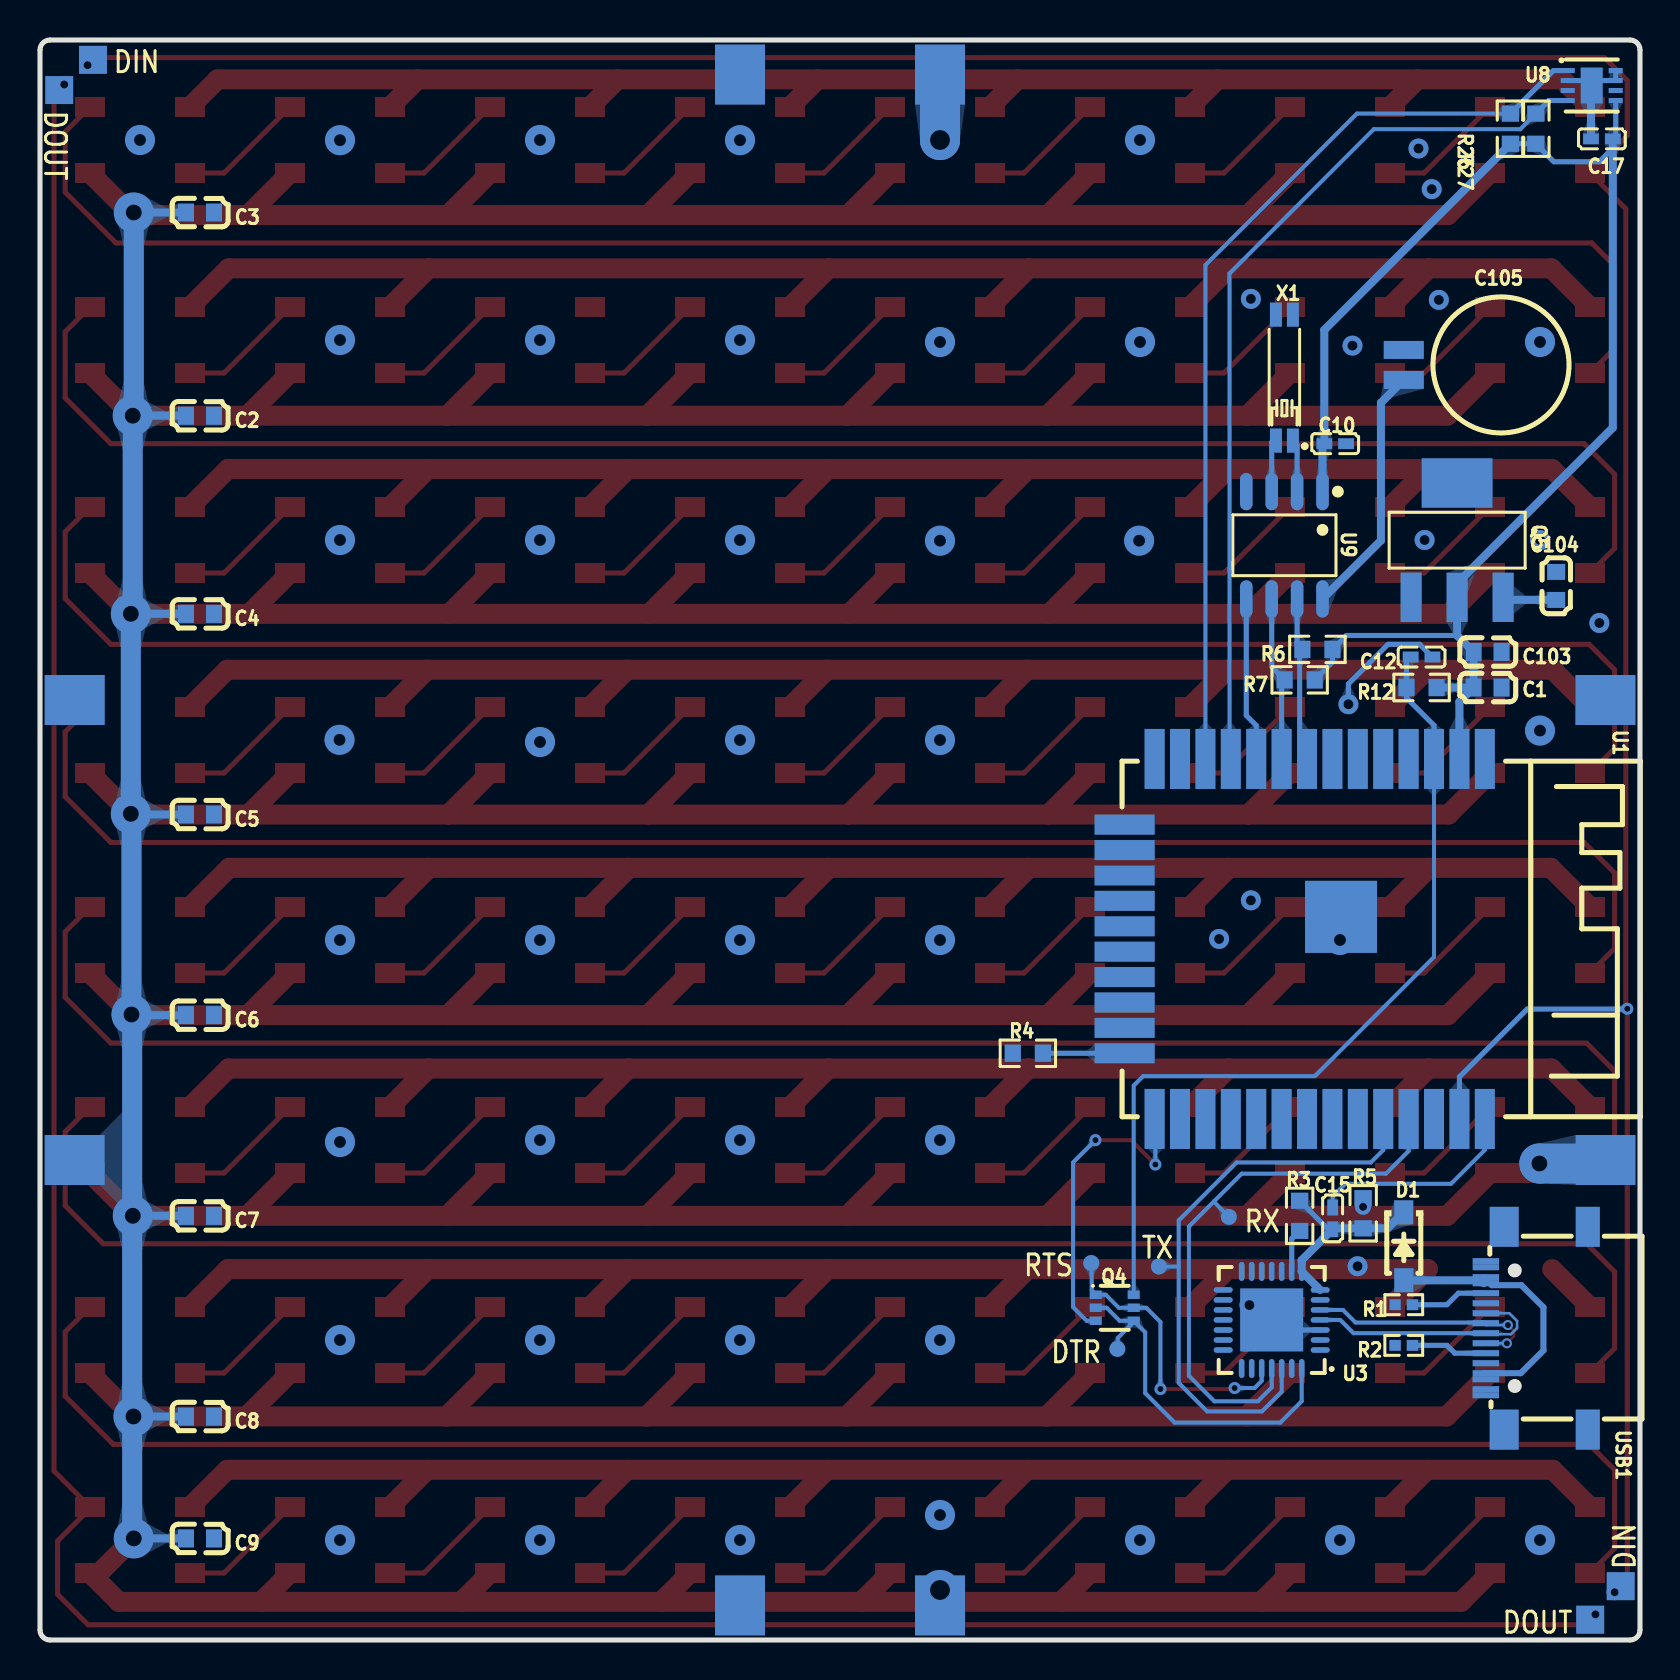
[diagram p3: board, bottom side, seen from below]

Outline 80 x 80 mm; copper layers: Top Layer, Bottom Layer. Coordinates in mm from the lower left corner of the outline.
Outline path: 0,79.5 0,0.5 arc(0.15,0.15) 0.5,0 79.5,0 arc(79.85,0.15) 80,0.5 80,79.5 arc(79.85,79.85) 79.5,80 0.5,80 arc(0.15,79.85) 0,79.5
Stack: Top Layer 0.035mm / Dielectric1 1.51mm FR4 er 4.5 / Bottom Layer 0.035mm

## Design rules (mm)
spacing safeClearance (default): track to track 0.1, other pairs 0.1 to 0.3
track width trackWidth (default): min 0.127, default 0.254, max 2.54
differential pair differentialPair (default): width min 0.127, default 0.254, max 2.54; gap min 0.152, default 0.152
via viaSize (default): diameter min 0.5, default 0.61, max 10; hole min 0.3, default 0.305, max 6

## Placement (name value [footprint] x y rotation side)
C1  100nF  [C0603]  7.62 47.62 0 bottom
C2  100nF  [C0603]  72 61.21 0 bottom
C3  100nF  [C0603]  72 71.37 0 bottom
C4  100nF  [C0603]  72 51.31 0 bottom
C5  100nF  [C0603]  72 41.28 0 bottom
C6  100nF  [C0603]  72 31.24 0 bottom
C7  100nF  [C0603]  72 21.21 0 bottom
C8  100nF  [C0603]  72 11.18 0 bottom
C9  100nF  [C0603]  72 5.08 0 bottom
C10  100nF  [C0402_NEW]  15.24 59.82 0 bottom
C12  1uF  [C0402_NEW]  10.92 49.15 0 bottom
C15  100nF  [C0402_NEW]  15.37 21.08 90 bottom
C17  100nF  [C0402_NEW]  1.91 75.06 0 bottom
C103  10uF  [C0603]  7.62 49.4 0 bottom
C104  10uF  [C0603]  4.19 52.7 270 bottom
C105  -  [CAP-TH_DMS3R3224]  11.81 63.75 0 bottom
D1  1N5819W  [SOD-123_L2.7-W1.6-LS3.7-RD-1]  11.81 19.69 270 bottom
LED1  WS2812B-B  [LED-SMD_4P-L5.0-W5.0-BL_TC5050RGB]  5 75 180 top
LED2  WS2812B-B  [LED-SMD_4P-L5.0-W5.0-BL_TC5050RGB]  15 75 180 top
LED3  WS2812B-B  [LED-SMD_4P-L5.0-W5.0-BL_TC5050RGB]  25 75 180 top
LED4  WS2812B-B  [LED-SMD_4P-L5.0-W5.0-BL_TC5050RGB]  35 75 180 top
LED5  WS2812B-B  [LED-SMD_4P-L5.0-W5.0-BL_TC5050RGB]  45 75 180 top
LED6  WS2812B-B  [LED-SMD_4P-L5.0-W5.0-BL_TC5050RGB]  55 75 180 top
LED7  WS2812B-B  [LED-SMD_4P-L5.0-W5.0-BL_TC5050RGB]  65 75 180 top
LED8  WS2812B-B  [LED-SMD_4P-L5.0-W5.0-BL_TC5050RGB]  75 75 180 top
LED9  WS2812B-B  [LED-SMD_4P-L5.0-W5.0-BL_TC5050RGB]  5 65 180 top
LED10  WS2812B-B  [LED-SMD_4P-L5.0-W5.0-BL_TC5050RGB]  15 65 180 top
LED11  WS2812B-B  [LED-SMD_4P-L5.0-W5.0-BL_TC5050RGB]  25 65 180 top
LED12  WS2812B-B  [LED-SMD_4P-L5.0-W5.0-BL_TC5050RGB]  35 65 180 top
LED13  WS2812B-B  [LED-SMD_4P-L5.0-W5.0-BL_TC5050RGB]  45 65 180 top
LED14  WS2812B-B  [LED-SMD_4P-L5.0-W5.0-BL_TC5050RGB]  55 65 180 top
LED15  WS2812B-B  [LED-SMD_4P-L5.0-W5.0-BL_TC5050RGB]  65 65 180 top
LED16  WS2812B-B  [LED-SMD_4P-L5.0-W5.0-BL_TC5050RGB]  75 65 180 top
LED17  WS2812B-B  [LED-SMD_4P-L5.0-W5.0-BL_TC5050RGB]  5 55 180 top
LED18  WS2812B-B  [LED-SMD_4P-L5.0-W5.0-BL_TC5050RGB]  15 55 180 top
LED19  WS2812B-B  [LED-SMD_4P-L5.0-W5.0-BL_TC5050RGB]  25 55 180 top
LED20  WS2812B-B  [LED-SMD_4P-L5.0-W5.0-BL_TC5050RGB]  35 55 180 top
LED21  WS2812B-B  [LED-SMD_4P-L5.0-W5.0-BL_TC5050RGB]  45 55 180 top
LED22  WS2812B-B  [LED-SMD_4P-L5.0-W5.0-BL_TC5050RGB]  55 55 180 top
LED23  WS2812B-B  [LED-SMD_4P-L5.0-W5.0-BL_TC5050RGB]  65 55 180 top
LED24  WS2812B-B  [LED-SMD_4P-L5.0-W5.0-BL_TC5050RGB]  75 55 180 top
LED25  WS2812B-B  [LED-SMD_4P-L5.0-W5.0-BL_TC5050RGB]  5 45 180 top
LED26  WS2812B-B  [LED-SMD_4P-L5.0-W5.0-BL_TC5050RGB]  15 45 180 top
LED27  WS2812B-B  [LED-SMD_4P-L5.0-W5.0-BL_TC5050RGB]  25 45 180 top
LED28  WS2812B-B  [LED-SMD_4P-L5.0-W5.0-BL_TC5050RGB]  35 45 180 top
LED29  WS2812B-B  [LED-SMD_4P-L5.0-W5.0-BL_TC5050RGB]  45 45 180 top
LED30  WS2812B-B  [LED-SMD_4P-L5.0-W5.0-BL_TC5050RGB]  55 45 180 top
LED31  WS2812B-B  [LED-SMD_4P-L5.0-W5.0-BL_TC5050RGB]  65 45 180 top
LED32  WS2812B-B  [LED-SMD_4P-L5.0-W5.0-BL_TC5050RGB]  75 45 180 top
LED33  WS2812B-B  [LED-SMD_4P-L5.0-W5.0-BL_TC5050RGB]  5 35 180 top
LED34  WS2812B-B  [LED-SMD_4P-L5.0-W5.0-BL_TC5050RGB]  15 35 180 top
LED35  WS2812B-B  [LED-SMD_4P-L5.0-W5.0-BL_TC5050RGB]  25 35 180 top
LED36  WS2812B-B  [LED-SMD_4P-L5.0-W5.0-BL_TC5050RGB]  35 35 180 top
LED37  WS2812B-B  [LED-SMD_4P-L5.0-W5.0-BL_TC5050RGB]  45 35 180 top
LED38  WS2812B-B  [LED-SMD_4P-L5.0-W5.0-BL_TC5050RGB]  55 35 180 top
LED39  WS2812B-B  [LED-SMD_4P-L5.0-W5.0-BL_TC5050RGB]  65 35 180 top
LED40  WS2812B-B  [LED-SMD_4P-L5.0-W5.0-BL_TC5050RGB]  75 35 180 top
LED41  WS2812B-B  [LED-SMD_4P-L5.0-W5.0-BL_TC5050RGB]  5 25 180 top
LED42  WS2812B-B  [LED-SMD_4P-L5.0-W5.0-BL_TC5050RGB]  15 25 180 top
LED43  WS2812B-B  [LED-SMD_4P-L5.0-W5.0-BL_TC5050RGB]  25 25 180 top
LED44  WS2812B-B  [LED-SMD_4P-L5.0-W5.0-BL_TC5050RGB]  35 25 180 top
LED45  WS2812B-B  [LED-SMD_4P-L5.0-W5.0-BL_TC5050RGB]  45 25 180 top
LED46  WS2812B-B  [LED-SMD_4P-L5.0-W5.0-BL_TC5050RGB]  55 25 180 top
LED47  WS2812B-B  [LED-SMD_4P-L5.0-W5.0-BL_TC5050RGB]  65 25 180 top
LED48  WS2812B-B  [LED-SMD_4P-L5.0-W5.0-BL_TC5050RGB]  75 25 180 top
LED49  WS2812B-B  [LED-SMD_4P-L5.0-W5.0-BL_TC5050RGB]  5 15 180 top
LED50  WS2812B-B  [LED-SMD_4P-L5.0-W5.0-BL_TC5050RGB]  15 15 180 top
LED51  WS2812B-B  [LED-SMD_4P-L5.0-W5.0-BL_TC5050RGB]  25 15 180 top
LED52  WS2812B-B  [LED-SMD_4P-L5.0-W5.0-BL_TC5050RGB]  35 15 180 top
LED53  WS2812B-B  [LED-SMD_4P-L5.0-W5.0-BL_TC5050RGB]  45 15 180 top
LED54  WS2812B-B  [LED-SMD_4P-L5.0-W5.0-BL_TC5050RGB]  55 15 180 top
LED55  WS2812B-B  [LED-SMD_4P-L5.0-W5.0-BL_TC5050RGB]  65 15 180 top
LED56  WS2812B-B  [LED-SMD_4P-L5.0-W5.0-BL_TC5050RGB]  75 15 180 top
LED57  WS2812B-B  [LED-SMD_4P-L5.0-W5.0-BL_TC5050RGB]  5 5 180 top
LED58  WS2812B-B  [LED-SMD_4P-L5.0-W5.0-BL_TC5050RGB]  15 5 180 top
LED59  WS2812B-B  [LED-SMD_4P-L5.0-W5.0-BL_TC5050RGB]  25 5 180 top
LED60  WS2812B-B  [LED-SMD_4P-L5.0-W5.0-BL_TC5050RGB]  35 5 180 top
LED61  WS2812B-B  [LED-SMD_4P-L5.0-W5.0-BL_TC5050RGB]  45 5 180 top
LED62  WS2812B-B  [LED-SMD_4P-L5.0-W5.0-BL_TC5050RGB]  55 5 180 top
LED63  WS2812B-B  [LED-SMD_4P-L5.0-W5.0-BL_TC5050RGB]  65 5 180 top
LED64  WS2812B-B  [LED-SMD_4P-L5.0-W5.0-BL_TC5050RGB]  75 5 180 top
NOREF  -  [Pad_e2642]  35 78.27 90 top
NOREF#2  -  [Pad_e2546]  1.73 24 0 top
NOREF#3  -  [Pad_e2645]  45 1.73 90 top
NOREF#4  -  [Pad_e16677]  26.13 14.55 180 top
NOREF#5  -  [Pad_e13453]  2.49 1.02 180 top
NOREF#6  -  [Pad_e13456]  0.97 2.69 180 top
NOREF#7  -  [Pad_e2644]  35 1.73 90 top
NOREF#8  -  [Pad_e16679]  20.56 21.16 180 top
NOREF#9  -  [Pad_e2646]  78.27 24 180 top
NOREF#10  -  [Pad_e16675]  27.44 18.85 180 top
NOREF#11  -  [Pad_e13457]  77.35 79.01 180 top
NOREF#12  -  [Pad_e2544]  1.73 47 0 top
NOREF#13  -  [Pad_e2641]  45 78.27 90 top
NOREF#14  -  [Pad_e16678]  24.06 18.68 180 top
NOREF#15  -  [Pad_e2647]  78.27 47 180 top
NOREF#16  -  [Pad_e13459]  79.04 77.5 180 top
Q4  UMH3N  [SC-70-6_L2.2-W1.3-P0.65-LS2.1-BR]  26.26 16.61 0 bottom
Q5  AMS1117-3.3V  [SOT-223_L6.5-W3.5-P2.30-LS7.0-BR]  9.14 54.99 270 bottom
R1  5.1K  [R0402]  11.81 16.76 180 bottom
R2  5.1K  [R0402]  11.81 14.73 0 bottom
R3  10K  [R0603]  17.02 21.21 270 bottom
R4  10K  [R0603]  30.61 29.34 180 bottom
R5  0R  [R0603]  13.84 21.34 90 bottom
R6  2.2K  [R0603]  16.13 49.53 180 bottom
R7  2.2K  [R0603]  17.02 48.01 180 bottom
R12  10K  [R0603]  10.92 47.62 180 bottom
R26  2.2K  [R0603]  6.48 75.56 270 bottom
R27  2.2K  [R0603]  5.21 75.56 270 bottom
U1  2.4GHz  [WIRELM-SMD_ESP32-S]  16.76 35.05 270 bottom
U3  -  [QFN-28_L5.0-W5.0-P0.50-TL-EP3.2]  18.41 16 0 bottom
U8  -  [DFN-8_L2.5-W2.5-P0.50-BL-EP]  2.41 77.72 270 bottom
U9  DS1302Z  [SOP-8_L4.9-W3.9-P1.27-LS6.0-BL-1]  17.78 54.74 0 bottom
USB1  -  [USB-C_16P_2]  -0.1 11.05 90 bottom
X1  32.768kHz  [MC-146_4P-L6.7-W1.5-P0.85-TL]  17.78 63.12 90 bottom

## Footprints (pads in the part's own frame, mm; a bottom-side part is the same pattern mirrored in y, then rotated)
C0402_NEW
  rect 0.79x0.54 smd: 1(-0.545,0) 2(0.545,0)
C0603
  rect 0.8x0.9 smd: 1(-0.7,0) 2(0.7,0)
CAP-TH_DMS3R3224
  rect 2x0.9 smd: 1(-0.002,0.75) 2(0.002,-0.75)
DFN-8_L2.5-W2.5-P0.50-BL-EP
  rect 0.249x0.701 smd: 1(-0.75,-1.199) 2(-0.249,-1.199) 3(0.249,-1.199) 4(0.75,-1.199) 5(0.75,1.199) 6(0.249,1.199) 7(-0.249,1.199) 8(-0.75,1.199)
  rect 1.801x1.1 smd: 9(0,0)
LED-SMD_4P-L5.0-W5.0-BL_TC5050RGB
  rect 1.5x1 smd: 1(-2.5,1.65) 2(-2.5,-1.65) 3(2.5,-1.65) 4(2.5,1.65)
MC-146_4P-L6.7-W1.5-P0.85-TL
  rect 1.2x0.6 smd: 1(-3.15,-0.425) 2(3.15,-0.425) 3(3.15,0.425) 4(-3.15,0.425)
Pad_e2544
  rect 3x2.5 smd far side: 1(0,0)
Pad_e2546
  rect 3x2.5 smd far side: 1(0,0)
Pad_e2641
  rect 3x2.5 smd far side: 1(0,0)
Pad_e2642
  rect 3x2.5 smd far side: 1(0,0)
Pad_e2644
  rect 3x2.5 smd far side: 1(0,0)
Pad_e2645
  rect 3x2.5 smd far side: 1(0,0)
Pad_e2646
  rect 3x2.5 smd far side: 1(0,0)
Pad_e2647
  rect 3x2.5 smd far side: 1(0,0)
Pad_e13453
  rect 1.397x1.397 smd far side: 1(0,0)
Pad_e13456
  rect 1.397x1.397 smd far side: 1(0,0)
Pad_e13457
  rect 1.397x1.397 smd far side: 1(0,0)
Pad_e13459
  rect 1.397x1.397 smd far side: 1(0,0)
Pad_e16675
  round 0.8 smd far side: 1(0,0)
Pad_e16677
  round 0.8 smd far side: 1(0,0)
Pad_e16678
  round 0.8 smd far side: 1(0,0)
Pad_e16679
  round 0.8 smd far side: 1(0,0)
QFN-28_L5.0-W5.0-P0.50-TL-EP3.2
  oval 0.95x0.28 smd: 1(-2.425,1.502) 2(-2.425,1.001) 3(-2.425,0.5) 4(-2.425,0) 5(-2.425,-0.5) 6(-2.425,-1) 7(-2.425,-1.501) 15(2.425,-1.501) 16(2.425,-1) 17(2.425,-0.5) 18(2.425,0) 19(2.425,0.5) 20(2.425,1.001) 21(2.425,1.502)
  oval 0.28x0.95 smd: 8(-1.502,-2.425) 9(-1.001,-2.425) 10(-0.5,-2.425) 11(0,-2.425) 12(0.5,-2.425) 13(1,-2.425) 14(1.501,-2.425) 22(1.501,2.425) 23(1,2.425) 24(0.5,2.425) 25(0,2.425) 26(-0.5,2.425) 27(-1.001,2.425) 28(-1.502,2.425)
  rect 3.15x3.15 smd: 29(0,0)
R0402
  rect 0.566x0.54 smd: 1(-0.433,0) 2(0.433,0)
R0603
  rect 0.806x0.864 smd: 1(-0.753,0) 2(0.753,0)
SC-70-6_L2.2-W1.3-P0.65-LS2.1-BR
  rect 0.6x0.42 smd: 1(0.95,-0.65) 2(0.95,0) 3(0.95,0.65) 4(-0.95,0.65) 5(-0.95,0) 6(-0.95,-0.65)
SOD-123_L2.7-W1.6-LS3.7-RD-1
  rect 1.2x0.95 smd: 1(-1.7,0) 2(1.7,0)
SOP-8_L4.9-W3.9-P1.27-LS6.0-BL-1
  oval 0.63x1.865 smd: 1(-1.905,-2.683) 2(-0.635,-2.683) 3(0.635,-2.683) 4(1.905,-2.683) 5(1.905,2.683) 6(0.635,2.683) 7(-0.635,2.683) 8(-1.905,2.683)
SOT-223_L6.5-W3.5-P2.30-LS7.0-BR
  rect 2.465x1.05 smd: 1(2.857,-2.3) 2(2.857,0) 3(2.857,2.3)
  rect 2.465x3.54 smd: 4(-2.857,0)
USB-C_16P_2
  rect 2x1.45 smd: 1(-0.53,6.893) 2(9.61,6.893)
  rect 2x1.2 smd: 3(-0.53,2.712) 4(9.61,2.712)
  rect 0.3x1.321 smd: A1(1.19,7.808) A4(1.99,7.808) A5(3.29,7.808) A6(4.29,7.808) A7(4.79,7.808) A8(5.79,7.808) A9(7.09,7.807) A12(7.89,7.808) B1(7.59,7.808) B4(6.79,7.807) B5(6.29,7.808) B6(5.29,7.808) B7(3.79,7.808) B8(2.79,7.808) B9(2.29,7.808) B12(1.49,7.808)
WIRELM-SMD_ESP32-S
  rect 3x1 smd: 1(-9,9.005) 2(-9,7.735) 3(-9,6.465) 4(-9,5.195) 5(-9,3.925) 6(-9,2.655) 7(-9,1.385) 8(-9,0.115) 9(-9,-1.155) 10(-9,-2.425) 11(-9,-3.695) 12(-9,-4.965) 13(-9,-6.235) 14(-9,-7.505) 25(9,-7.505) 26(9,-6.235) 27(9,-4.965) 28(9,-3.695) 29(9,-2.425) 30(9,-1.155) 31(9,0.115) 32(9,1.385) 33(9,2.655) 34(9,3.925) 35(9,5.195) 36(9,6.465) 37(9,7.735) 38(9,9.005)
  rect 1x3 smd: 15(-5.715,-9.005) 16(-4.445,-9.005) 17(-3.175,-9.005) 18(-1.905,-9.005) 19(-0.635,-9.005) 20(0.635,-9.005) 21(1.905,-9.005) 22(3.175,-9.005) 23(4.445,-9.005) 24(5.715,-9.005)
  rect 3.6x3.6 smd: 39(-1.105,1.815)

## Nets
As in the schematic, except:
GND: C1.1 C2.1 C3.1 C4.1 C5.1 C6.1 C7.1 C8.1 C9.1 C10.1 C12.1 C15.2 C17.2 C103.1 C104.1 C105.2 LED1.3 LED2.3 LED3.3 LED4.3 LED5.3 LED6.3 LED7.3 LED8.3 LED9.3 LED10.3 LED11.3 LED12.3 LED13.3 LED14.3 LED15.3 LED16.3 LED17.3 LED18.3 LED19.3 LED20.3 LED21.3 LED22.3 LED23.3 LED24.3 LED25.3 LED26.3 LED27.3 LED28.3 LED29.3 LED30.3 LED31.3 LED32.3 LED33.3 LED34.3 LED35.3 LED36.3 LED37.3 LED38.3 LED39.3 LED40.3 LED41.3 LED42.3 LED43.3 LED44.3 LED45.3 LED46.3 LED47.3 LED48.3 LED49.3 LED50.3 LED51.3 LED52.3 LED53.3 LED54.3 LED55.3 LED56.3 LED57.3 LED58.3 LED59.3 LED60.3 LED61.3 LED62.3 LED63.3 LED64.3 NOREF#3.1 NOREF#12.1 NOREF#13.1 NOREF#15.1 Q5.1 R1.1 R2.2 R4.1 U1.1 U1.15 U1.38 U1.39 U3.3 U3.29 U8.2 U8.7 U8.8 U8.9 U9.4 USB1.1 USB1.2 USB1.3 USB1.4 USB1.A1 USB1.A12 USB1.B1 USB1.B12
CP_RX: NOREF#8.1 U1.35 U3.25
CP_TX: NOREF#14.1 U1.34 U3.26
DIN: LED1.4 NOREF#6.1 NOREF#11.1 U1.37
DOUT: LED64.2 NOREF#5.1 NOREF#16.1
DTR: NOREF#4.1 Q4.2 Q4.4 U3.28
RTS: NOREF#10.1 Q4.1 Q4.5 U3.24
VLED: C2.2 C3.2 C4.2 C5.2 C6.2 C7.2 C8.2 C9.2 LED1.1 LED2.1 LED3.1 LED4.1 LED5.1 LED6.1 LED7.1 LED8.1 LED9.1 LED10.1 LED11.1 LED12.1 LED13.1 LED14.1 LED15.1 LED16.1 LED17.1 LED18.1 LED19.1 LED20.1 LED21.1 LED22.1 LED23.1 LED24.1 LED25.1 LED26.1 LED27.1 LED28.1 LED29.1 LED30.1 LED31.1 LED32.1 LED33.1 LED34.1 LED35.1 LED36.1 LED37.1 LED38.1 LED39.1 LED40.1 LED41.1 LED42.1 LED43.1 LED44.1 LED45.1 LED46.1 LED47.1 LED48.1 LED49.1 LED50.1 LED51.1 LED52.1 LED53.1 LED54.1 LED55.1 LED56.1 LED57.1 LED58.1 LED59.1 LED60.1 LED61.1 LED62.1 LED63.1 LED64.1 NOREF.1 NOREF#2.1 NOREF#7.1 NOREF#9.1 R5.2

Pads without a net: Q5 4; U1 4 5 6 7 13 14 16 17 18 19 20 21 22 23 26 27 28 29 30 31 32 33 36; U3 1 2 6 10 11 12 13 14 15 16 17 18 19 20 21 22 23 27; U8 3 6; USB1 A8 B8; X1 2 3

## Via types
v1: diameter 1.5, hole 0.6, Top Layer to Bottom Layer, 41 vias
v2: diameter 1, hole 0.5, Top Layer to Bottom Layer, 13 vias
v3: diameter 0.6, hole 0.305, Top Layer to Bottom Layer, 5 vias
v4: diameter 0.5, hole 0.305, Top Layer to Bottom Layer, 2 vias
v5: diameter 0.8, hole 0.4, Top Layer to Bottom Layer, 5 vias
v6: diameter 2, hole 0.8, Top Layer to Bottom Layer, 9 vias
v7: diameter 2, hole 1, Top Layer to Bottom Layer, 2 vias

## Routing (per net, layer and track width the routed paths; a pad name or vN(x,y) marks a point on that pad's centre or on a via; arc(x,y) is an arc through that point)
3.3V: length 74.2
  Bottom Layer w0.254: 9.14,50.23 14.68,50.23 R6.2 15.38,48.89 R7.2 ; R26.2 R27.2 4.31,73.91 2.03,73.91 1.4,74.55 ; 1.4,75.02 C17.1 1.21,75.2 U8.5
  Bottom Layer w0.4: U9.1 15.88,59.73 C10.2 15.78,65.5 R26.2 ; C17.1 1.36,60.62 9.14,52.83 Q5.2 9.14,50.23 C103.2 C1.2 ; U1.2 9.03,46.92 C1.2 ; C1.2 R12.2
GND: length 713.2
  Top Layer w1: 10.57,68.58 4.43,68.58 LED9.3 ; 10.57,68.58 LED10.3 ; 10.57,68.58 20.57,68.58 ; LED22.3 50.6,58.55 ; 50.6,58.55 60.6,58.55 ; 50.6,58.55 40.6,58.55 ; 10.54,38.61 20.54,38.61 ; 10.54,38.61 4.46,38.61 LED33.3 ; 10.54,38.61 LED34.3 ; 20.54,38.61 LED35.3 ; 20.54,38.61 30.54,38.61 ; 10.6,58.55 4.4,58.55 LED17.3 ; 10.6,58.55 LED18.3 ; 10.6,58.55 20.6,58.55 ; 30.57,68.58 40.57,68.58 ; 30.57,68.58 20.57,68.58 ; 30.57,68.58 LED12.3 ; 40.57,68.58 LED13.3 ; 40.57,68.58 60.57,68.58 ; 30.64,8.51 40.64,8.51 ; 30.64,8.51 20.64,8.51 ; 30.64,8.51 LED60.3 ; 40.64,8.51 50.64,8.51 ; 40.64,8.51 LED61.3 ; 31.12,78.03 21.12,78.03 ; 31.12,78.03 41.12,78.03 ; 31.12,78.03 LED4.3 ; 21.12,78.03 LED3.3 ; 21.12,78.03 11.12,78.03 ; 20.61,18.54 10.61,18.54 LED50.3 ; 20.61,18.54 30.61,18.54 ; 20.61,18.54 LED51.3 ; 30.61,18.54 40.61,18.54 ; 30.61,18.54 LED52.3 ; 40.61,18.54 50.61,18.54 ; 40.61,18.54 LED53.3 ; 60.57,28.58 70.57,28.58 LED48.3 ; 60.57,28.58 50.57,28.58 ; 60.57,28.58 LED47.3 ; LED37.3 40.54,38.61 ; 40.54,38.61 50.54,38.61 ; 40.54,38.61 30.54,38.61 ; LED40.3 70.54,38.61 60.54,38.61 ; 60.6,58.55 LED23.3 ; 60.6,58.55 70.6,58.55 LED24.3 ; 50.61,18.54 60.61,18.54 ; 50.61,18.54 LED54.3 ; 41.12,78.03 51.12,78.03 ; 41.12,78.03 LED5.3 ; 10.64,8.51 20.64,8.51 ; 10.64,8.51 4.36,8.51 LED57.3 ; 10.64,8.51 LED58.3 ; 20.64,8.51 LED59.3 ; 60.57,68.58 70.57,68.58 LED16.3 ; 60.57,68.58 LED15.3 ; LED36.3 30.54,38.61 ; 61.12,78.03 51.12,78.03 ; 61.12,78.03 71.12,78.03 LED8.3 ; 61.12,78.03 LED7.3 ; 51.12,78.03 LED6.3 ; 20.57,28.58 30.57,28.58 ; 20.57,28.58 10.58,28.58 ; 20.57,28.58 LED43.3 ; 30.57,28.58 LED44.3 ; 30.57,28.58 40.57,28.58 ; LED55.3 60.61,18.54 ; 60.61,18.54 70.61,18.54 LED56.3 ; LED30.3 50.64,48.51 ; 50.64,48.51 40.64,48.51 ; 50.64,48.51 60.64,48.51 ; LED19.3 20.6,58.55 ; 20.6,58.55 30.6,58.55 ; LED49.3 4.39,18.54 ; 30.64,48.51 40.64,48.51 ; 30.64,48.51 LED28.3 ; 30.64,48.51 20.64,48.51 ; 40.64,48.51 LED29.3 ; LED20.3 30.6,58.55 ; 30.6,58.55 40.6,58.55 ; LED32.3 70.64,48.51 60.64,48.51 ; LED1.3 3.88,78.03 11.12,78.03 ; 10.58,28.58 4.42,28.58 LED41.3 ; 10.58,28.58 LED42.3 ; 50.54,38.61 LED38.3 ; 50.54,38.61 60.54,38.61 ; LED21.3 40.6,58.55 ; 60.64,8.51 70.64,8.51 LED64.3 ; 60.64,8.51 50.64,8.51 ; 60.64,8.51 LED63.3 ; 11.12,78.03 LED2.3 ; LED26.3 10.64,48.51 ; 10.64,48.51 20.64,48.51 ; 10.64,48.51 4.36,48.51 LED25.3 ; 50.64,8.51 LED62.3 ; 50.57,28.58 LED46.3 ; 50.57,28.58 40.57,28.58 ; 20.57,68.58 LED11.3 ; 40.57,28.58 LED45.3 ; 60.64,48.51 LED31.3 ; 20.64,48.51 LED27.3 ; 60.54,38.61 LED39.3
  Bottom Layer w0.2: 15.37,21.63 15.37,22.17 14.73,22.81 9.45,22.81 7.76,24.5 U1.38
  Bottom Layer w0.254: 14.58,46.94 14.58,47.8 12.6,49.78 11.01,49.78 C12.1 ; U3.3 17.91,15.5 U3.29 ; U8.2 2.66,77.97 U8.9 2.16,77.97 U8.7 U8.8
  Bottom Layer w0.4: U8.9 2.45,77.69 C17.2
  vias: v1(5,64.9) v1(5,45.47) v1(5,5) v1(15,35) v1(15,5) v1(25,75) v1(25,64.9) v1(25.04,54.97) v1(25,5) v1(35,64.9) v1(35,54.97) v1(35,45) v1(35,35) v1(35,25) v1(35,15) v1(35,6.25) v1(45,74.99) v1(45,65) v1(45,55) v1(45,45) v1(45,35) v1(45,25) v1(45,15) v1(45,5) v1(55,75) v1(55,65) v1(55,55) v1(55,44.9) v1(55,35) v1(55,25) v1(55,15) v1(55,5) v1(65,74.99) v1(65,65) v1(65,55) v1(65.02,45.01) v1(65,35) v1(65,24.9) v1(65,15) v1(65,5) v1(75,75) v2(2.03,50.85) v2(5,55) v2(10.06,67) v2(10.41,72.54) v2(10.77,55) v2(11.07,74.57) v2(14.12,18.69) v2(14.38,64.72) v2(14.58,46.79) v2(19.46,67.06) v2(19.46,36.98) v2(19.53,16.75) v2(21.05,35.05)
VCC: length 10.2
  Bottom Layer w0.254: R3.1 15.59,20.54 C15.1
  Bottom Layer w0.4: U3.7 U3.8 16.91,18.99 C15.1 15.32,20.58 R5.1 12.61,20.58 D1.1
BOOT: length 16
  Top Layer w0.2: v3(24.23,23.77) 25.45,24.99 v3(27.23,24.99)
  Bottom Layer w0.2: v3(27.23,24.99) 28.35,23.88 28.35,16.64 27.66,15.96 Q4.3 ; U1.25 24.23,26.01 v3(24.23,23.77)
CP_RX: length 28.8
  Bottom Layer w0.2: U1.35 11.57,24.45 12.7,23.32 19.91,23.32 21.29,21.94 ; 21.29,21.94 21.29,21.89 20.54,21.14 20.35,21.14 ; 21.29,21.94 22.56,20.68 22.56,13.21 21.28,11.94 19.1,11.94 18.41,12.62 U3.25
CP_TX: length 29.7
  Bottom Layer w0.2: 23.06,18.67 23.06,12.85 21.64,11.43 18.9,11.43 17.91,12.41 U3.26 ; 23.06,18.67 24.04,18.67 24.08,18.63 ; 23.06,18.67 23.06,20.98 20.17,23.88 13.46,23.88 12.84,24.5 U1.34
D+: length 12.4
  Bottom Layer w0.127: 7.81,16.34 6.53,16.34 6.15,15.95 6.15,15.6 6.45,15.29 7.81,15.29
  Bottom Layer w0.2: U3.4 14.99,16 14.32,15.34 7.81,15.34
D-: length 12
  Top Layer w0.127: v4(6.66,14.83) 6.3,15.19 6.3,15.44 v4(6.6,15.75)
  Bottom Layer w0.127: v4(6.66,14.83) 7.8,14.83 7.81,14.84 ; v4(6.6,15.75) 7.72,15.75 7.81,15.84
  Bottom Layer w0.2: 7.81,15.84 7.84,15.88 14.22,15.88 14.85,16.5 U3.5
DIN: length 166.8
  Top Layer w0.254: v5(1.27,2.39) 0.64,3.02 v3(0.64,31.56) 0.71,31.64 0.71,71.56 LED1.4 0.64,75.22 0.64,77.98 1.78,79.12 77.24,79.12 v5(77.62,78.74)
  Bottom Layer w0.254: U1.37 9.03,28.16 5.64,31.55 0.71,31.55
DOUT: length 154.9
  Top Layer w0.254: 78.87,77.85 79.3,77.42 79.3,8.45 LED64.2 77.5,6.57 79.12,4.95 79.12,2.29 77.6,0.76 2.74,0.76 2.23,1.27
  vias: v5(2.23,1.28) v5(78.79,77.78)
DS1302_CE: length 8.2
  Bottom Layer w0.254: U9.5 19.69,46.23 19.19,45.73 U1.10
DS1302_CLK: length 8.3
  Bottom Layer w0.254: U1.8 17.02,44.42 17.02,49.39 R6.1 17.14,49.79 U9.7
DS1302_SDA: length 8.3
  Bottom Layer w0.254: U1.9 17.92,47.86 R7.1 18.41,48.65 U9.6
DTR: length 18.2
  Bottom Layer w0.2: U3.28 16.91,11.94 17.98,10.87 23.27,10.87 24.74,12.34 24.74,15.39 Q4.4 26.02,15.96 26.67,16.61 Q4.2 ; 25.3,15.91 26.11,15.1 26.11,14.62
ESP_EN: length 43.8
  Bottom Layer w0.2: Q4.6 25.31,27.72 24.84,28.19 16.26,28.19 10.3,34.15 10.3,44.05
  Bottom Layer w0.254: 10.3,44.05 10.3,45.73 11.68,47.11 R12.1 11.68,48.94 C12.2
RTS: length 14.7
  Top Layer w0.2: v3(23.98,12.55) 20.32,12.55 v3(20.27,12.6)
  Bottom Layer w0.2: U3.24 18.92,12.95 19.27,12.6 v3(20.27,12.6) ; 27.19,17.26 27.42,17.49 27.42,18.87 ; 27.19,17.26 27.18,17.24 ; 27.19,17.26 Q4.1 ; 27.19,17.26 26.71,17.26 26.06,16.61 Q4.5 24.69,16.61 23.98,15.9 v3(23.98,12.55)
SHT_SCL: length 44.8
  Bottom Layer w0.2: U1.11 20.52,44.12 20.52,68.33 13.31,75.54 5.99,75.54 R27.1
  Bottom Layer w0.254: U8.4 4.55,76.97 R27.1
SHT_SDA: length 46.8
  Bottom Layer w0.2: U1.12 21.73,68.75 14.16,76.32 R26.1
  Bottom Layer w0.254: U8.1 4.32,78.47 R26.1
VLED: length 811.1
  Top Layer w1: LED8.1 75.4,71.25 69.6,71.25 ; 18.94,1.91 28.94,1.91 ; 18.94,1.91 8.94,1.91 LED57.1 ; 18.94,1.91 LED58.1 ; 28.94,1.91 38.94,1.91 ; 28.94,1.91 LED59.1 ; LED45.1 49.64,21.21 ; 49.64,21.21 59.64,21.21 ; 49.64,21.21 39.64,21.21 ; LED32.1 75.43,41.28 69.57,41.28 ; LED22.1 59.54,51.31 ; 59.54,51.31 69.54,51.31 ; 59.54,51.31 49.54,51.31 ; 49.54,51.31 39.54,51.31 ; 49.54,51.31 LED21.1 ; 39.54,51.31 LED20.1 ; 39.54,51.31 29.54,51.31 ; LED2.1 19.6,71.25 ; 19.6,71.25 9.6,71.25 LED1.1 ; 19.6,71.25 29.6,71.25 ; LED17.1 9.54,51.31 19.54,51.31 ; LED9.1 9.64,61.21 19.64,61.21 ; 49.61,31.24 39.61,31.24 ; 49.61,31.24 59.61,31.24 ; 49.61,31.24 LED37.1 ; 39.61,31.24 29.61,31.24 ; 39.61,31.24 LED36.1 ; 69.67,11.18 v6(75.33,11.18) LED56.1 ; 69.67,11.18 59.67,11.18 ; 69.67,11.18 LED55.1 ; LED25.1 9.58,41.28 19.57,41.28 ; LED18.1 19.54,51.31 ; 19.54,51.31 29.54,51.31 ; LED15.1 69.64,61.21 ; 69.64,61.21 59.64,61.21 ; 69.64,61.21 v6(75.36,61.21) LED16.1 ; 59.64,21.21 69.64,21.21 ; 59.64,21.21 LED46.1 ; 39.64,21.21 29.64,21.21 ; 39.64,21.21 LED44.1 ; 29.64,21.21 LED43.1 ; 29.64,21.21 19.64,21.21 ; 49.64,61.21 59.64,61.21 ; 49.64,61.21 39.64,61.21 ; 49.64,61.21 LED13.1 ; 59.64,61.21 LED14.1 ; LED60.1 38.94,1.91 ; 38.94,1.91 48.94,1.91 ; 29.54,51.31 LED19.1 ; v6(5.03,23.83) 5.5,23.35 LED41.1 9.64,21.21 19.64,21.21 ; 59.61,31.24 LED38.1 ; 59.61,31.24 69.61,31.24 ; 29.57,41.28 19.57,41.28 ; 29.57,41.28 LED27.1 ; 29.57,41.28 39.57,41.28 ; 19.57,41.28 LED26.1 ; LED10.1 19.64,61.21 ; 19.64,61.21 29.64,61.21 ; LED11.1 29.64,61.21 ; 29.64,61.21 39.64,61.21 ; 59.67,11.18 49.67,11.18 ; 59.67,11.18 LED54.1 ; 49.67,11.18 39.67,11.18 ; 49.67,11.18 LED53.1 ; 69.6,71.25 59.6,71.25 ; 69.6,71.25 LED7.1 ; 59.6,71.25 49.6,71.25 ; 59.6,71.25 LED6.1 ; 69.64,21.21 v6(75.36,21.21) LED48.1 ; 69.64,21.21 LED47.1 ; 39.67,11.18 LED52.1 ; 39.67,11.18 29.67,11.18 ; 29.67,11.18 19.67,11.18 ; 29.67,11.18 LED51.1 ; 19.67,11.18 9.67,11.18 LED49.1 ; 19.67,11.18 LED50.1 ; 49.6,71.25 LED5.1 ; 49.6,71.25 39.6,71.25 ; 59.57,41.28 49.57,41.28 ; 59.57,41.28 69.57,41.28 ; 59.57,41.28 LED30.1 ; 49.57,41.28 LED29.1 ; 49.57,41.28 39.57,41.28 ; 48.94,1.91 58.94,1.91 ; 48.94,1.91 LED61.1 ; 19.64,21.21 LED42.1 ; LED33.1 9.61,31.24 19.61,31.24 ; LED28.1 39.57,41.28 ; 39.6,71.25 29.6,71.25 ; 39.6,71.25 LED4.1 ; 29.6,71.25 LED3.1 ; 39.64,61.21 LED12.1 ; v6(75.31,5.08) 77.04,3.35 LED64.1 76.06,1.91 68.94,1.91 ; 69.61,31.24 75.39,31.24 LED40.1 ; 69.61,31.24 LED39.1 ; 58.94,1.91 68.94,1.91 ; 58.94,1.91 LED62.1 ; LED23.1 69.54,51.31 ; 69.54,51.31 v6(75.46,51.31) LED24.1 ; 29.61,31.24 LED35.1 ; 29.61,31.24 19.61,31.24 ; LED34.1 19.61,31.24 ; 68.94,1.91 LED63.1 ; 69.57,41.28 LED31.1
  Bottom Layer w0.4: C8.2 v6(75.33,11.18) ; C4.2 v6(75.46,51.31) ; C5.2 75.43,41.28 ; C2.2 v6(75.36,61.21) ; v6(75.31,5.08) C9.2 ; C7.2 75.18,21.21 75.39,21.42 ; C6.2 75.39,31.24 ; C3.2 v6(75.31,71.37)
  Bottom Layer w1: v6(75.31,71.37) 75.31,61.27 v6(75.36,61.21) 75.36,51.4 v6(75.46,51.31) v6(75.46,41.31) 75.43,41.28 v6(75.43,31.28) 75.39,31.24 75.39,5.16 v6(75.31,5.08)
  Bottom Layer w2: NOREF.1 v7(35,75) ; v6(5.03,23.83) 1.73,23.83
  vias: v5(13.85,21.66) v7(35,2.5)
VUSB: length 13.3
  Bottom Layer w0.3: 7.81,13.34 5.97,13.34 4.83,14.48 4.83,16.64 5.93,17.74 7.41,17.74 7.81,18.14
  Bottom Layer w0.4: D1.2 7.95,17.99 7.81,17.84
$1N1863: length 3.8
  Bottom Layer w0.254: R1.2 9.65,16.76 9.08,17.34 7.81,17.34
$1N1869: length 3.7
  Bottom Layer w0.254: 7.81,14.34 9.26,14.34 9.65,14.73 R2.1
$1N1877: length 2.2
  Bottom Layer w0.254: R3.2 17.41,20.06 U3.9
$1N30818: length 2.7
  Bottom Layer w0.4: Q5.3 6.72,52 C104.2
$1N36355: length 4.1
  Bottom Layer w0.254: R4.2 U1.24
$1N37451: length 2.6
  Bottom Layer w0.254: U9.2 17.14,59.76 X1.1
$1N37470: length 2.6
  Bottom Layer w0.254: U9.3 18.41,59.89 18.33,59.97
$1N37627: length 12.6
  Bottom Layer w0.4: U9.8 12.95,54.98 12.95,61.86 C105.1
$2N49017: length 6.4
  Top Layer w0.254: LED2.4 10.8,73.35 LED1.2
$2N49022: length 6.4
  Top Layer w0.254: LED2.2 20.8,73.35 LED3.4
$2N49027: length 6.4
  Top Layer w0.254: LED4.4 30.8,73.35 LED3.2
$2N49225: length 6.4
  Top Layer w0.254: LED6.4 50.8,73.35 LED5.2
$2N49226: length 6.4
  Top Layer w0.254: LED6.2 60.8,73.35 LED7.4
$2N49317: length 6.4
  Top Layer w0.254: LED4.2 40.8,73.35 LED5.4
$2N50284: length 6.4
  Top Layer w0.254: LED10.4 10.8,63.35 LED9.2
$2N50285: length 6.4
  Top Layer w0.254: LED10.2 20.8,63.35 LED11.4
$2N50286: length 6.4
  Top Layer w0.254: LED11.2 30.8,63.35 LED12.4
$2N50287: length 6.4
  Top Layer w0.254: LED14.4 50.8,63.35 LED13.2
$2N50288: length 6.4
  Top Layer w0.254: LED14.2 60.8,63.35 LED15.4
$2N50289: length 6.4
  Top Layer w0.254: LED15.2 70.8,63.35 LED16.4
$2N50290: length 6.4
  Top Layer w0.254: LED13.4 40.8,63.35 LED12.2
$2N50470: length 89.7
  Top Layer w0.254: 2.54,63.31 1.27,64.58 1.27,68.71 2.41,69.85 ; 2.41,69.85 2.4,69.85 ; 2.41,69.85 76.2,69.85 78.74,72.39 78.74,75.41 LED8.2
$2N50637: length 6.4
  Top Layer w0.254: LED8.4 70.8,73.35 LED7.2
$2N52267: length 6.4
  Top Layer w0.254: LED18.4 10.8,53.35 LED17.2
$2N52268: length 6.4
  Top Layer w0.254: LED18.2 20.8,53.35 LED19.4
$2N52269: length 6.4
  Top Layer w0.254: LED20.4 30.8,53.35 LED19.2
$2N52270: length 6.4
  Top Layer w0.254: LED22.4 50.8,53.35 LED21.2
$2N52271: length 6.4
  Top Layer w0.254: LED23.4 60.8,53.35 LED22.2
$2N52272: length 6.4
  Top Layer w0.254: LED21.4 40.8,53.35 LED20.2
$2N52273: length 6.4
  Top Layer w0.254: LED26.4 10.8,43.35 LED25.2
$2N52274: length 6.4
  Top Layer w0.254: LED27.4 20.8,43.35 LED26.2
$2N52275: length 6.4
  Top Layer w0.254: LED28.4 30.8,43.35 LED27.2
$2N52276: length 6.4
  Top Layer w0.254: LED29.2 50.8,43.35 LED30.4
$2N52277: length 6.4
  Top Layer w0.254: LED31.4 60.8,43.35 LED30.2
$2N52278: length 6.4
  Top Layer w0.254: LED32.4 70.8,43.35 LED31.2
$2N52279: length 6.4
  Top Layer w0.254: LED28.2 40.8,43.35 LED29.4
$2N52280: length 89.7
  Top Layer w0.254: LED24.2 78.74,55.41 78.74,52.07 76.45,49.78 2.54,49.78 1.27,48.51 1.27,44.58 LED25.4
$2N52282: length 6.4
  Top Layer w0.254: LED23.2 70.8,53.35 LED24.4
$2N53315: length 89.4
  Top Layer w0.254: 2.38,53.47 1.27,54.58 1.27,58.29 2.79,59.82 76.45,59.82 78.74,62.1 78.74,65.41 LED16.2
$2N55722: length 6.4
  Top Layer w0.254: LED33.2 10.8,33.35 LED34.4
$2N55723: length 6.4
  Top Layer w0.254: LED35.4 20.8,33.35 LED34.2
$2N55724: length 6.4
  Top Layer w0.254: LED35.2 30.8,33.35 LED36.4
$2N55725: length 6.4
  Top Layer w0.254: LED38.4 50.8,33.35 LED37.2
$2N55726: length 6.4
  Top Layer w0.254: LED38.2 60.8,33.35 LED39.4
$2N55727: length 6.4
  Top Layer w0.254: LED36.2 40.8,33.35 LED37.4
$2N55728: length 6.4
  Top Layer w0.254: LED41.2 10.8,23.35 LED42.4
$2N55729: length 6.4
  Top Layer w0.254: LED42.2 20.8,23.35 LED43.4
$2N55730: length 6.4
  Top Layer w0.254: LED44.4 30.8,23.35 LED43.2
$2N55731: length 6.4
  Top Layer w0.254: LED46.4 50.8,23.35 LED45.2
$2N55732: length 6.4
  Top Layer w0.254: LED46.2 60.8,23.35 LED47.4
$2N55733: length 6.4
  Top Layer w0.254: LED48.4 70.8,23.35 LED47.2
$2N55734: length 6.4
  Top Layer w0.254: LED45.4 40.8,23.35 LED44.2
$2N55735: length 89.6
  Top Layer w0.254: LED40.2 78.74,35.41 78.74,32.13 76.45,29.84 2.67,29.84 1.27,28.45 1.27,24.58 LED41.4
$2N55736: length 6.4
  Top Layer w0.254: LED39.2 70.8,33.35 LED40.4
$2N55738: length 6.4
  Top Layer w0.254: LED49.2 10.8,13.35 LED50.4
$2N55739: length 6.4
  Top Layer w0.254: LED50.2 20.8,13.35 LED51.4
$2N55740: length 6.4
  Top Layer w0.254: LED51.2 30.8,13.35 LED52.4
$2N55741: length 6.4
  Top Layer w0.254: LED54.4 50.8,13.35 LED53.2
$2N55742: length 6.4
  Top Layer w0.254: LED55.4 60.8,13.35 LED54.2
$2N55743: length 6.4
  Top Layer w0.254: LED53.4 40.8,13.35 LED52.2
$2N55744: length 6.4
  Top Layer w0.254: LED57.2 10.8,3.35 LED58.4
$2N55745: length 6.4
  Top Layer w0.254: LED58.2 20.8,3.35 LED59.4
$2N55746: length 6.4
  Top Layer w0.254: LED59.2 30.8,3.35 LED60.4
$2N55747: length 6.4
  Top Layer w0.254: LED61.2 50.8,3.35 LED62.4
$2N55748: length 6.4
  Top Layer w0.254: LED62.2 60.8,3.35 LED63.4
$2N55749: length 6.4
  Top Layer w0.254: LED63.2 70.8,3.35 LED64.4
$2N55750: length 6.4
  Top Layer w0.254: LED60.2 40.8,3.35 LED61.4
$2N55751: length 89.9
  Top Layer w0.254: LED49.4 1.27,14.58 1.27,18.41 2.67,19.81 76.84,19.81 78.74,21.72 78.74,25.41 LED48.2
$2N55753: length 6.4
  Top Layer w0.254: LED55.2 70.8,13.35 LED56.4
$2N55754: length 89.6
  Top Layer w0.254: LED56.2 78.74,15.41 78.74,12.19 76.33,9.78 2.54,9.78 1.27,8.51 1.27,4.58 LED57.4
$2N56561: length 89.6
  Top Layer w0.254: LED32.2 78.74,45.41 78.74,42.16 76.45,39.88 2.79,39.88 1.27,38.35 1.27,34.58 LED33.4

## Copper pours and planes (outline as drawn; the poured copper is in the pictures)
GND on Top Layer: 0,80 80,80 80,0 0,0
GND on Bottom Layer: 0,80 80,80 80,0 0,0
VLED on Top Layer: 33.58,75.79 39.6,75.79 39.6,71.25 33.58,71.25
VLED on Bottom Layer: 75.39,26.41 78.27,26.41 78.27,21.42 75.39,21.42

Small or netless copper shapes (teardrops, artwork), in the pictures only: 287 on Top Layer, 142 on Bottom Layer

## Text on the board
Bottom Silkscreen Layer: DOUT | RX | TX | DTR | RTS | DIN
